# Altium project Gate Driver Board Motor Controller.PrjPcb (part 1 of 2)
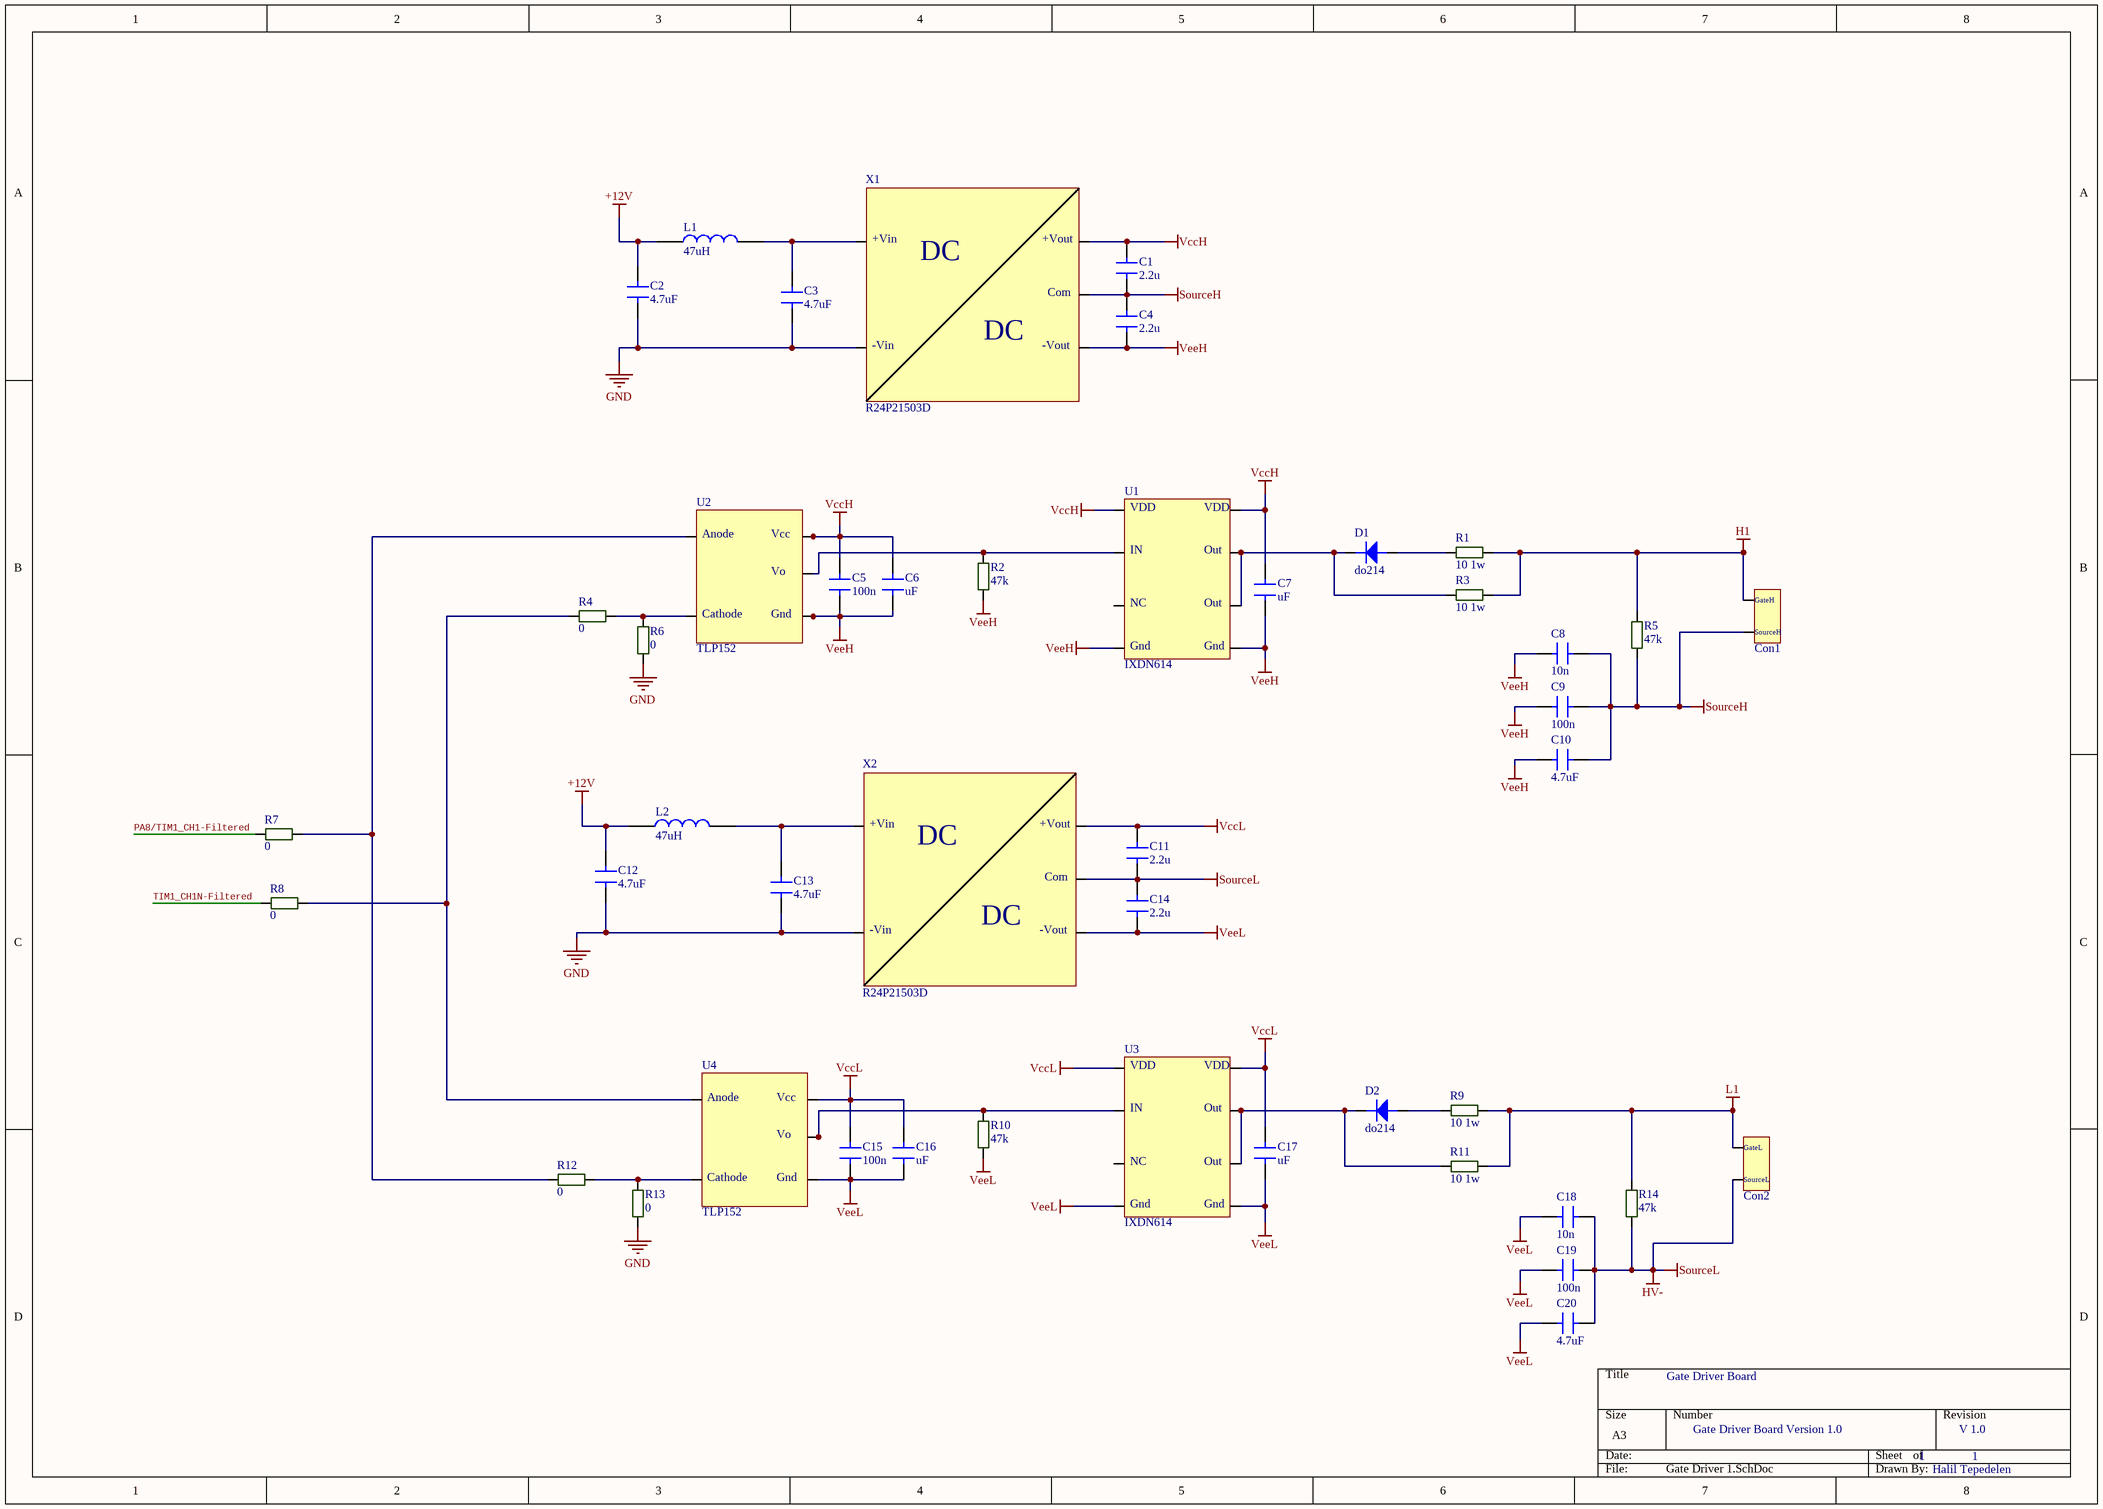
[diagram p0: Gate Driver 1.SchDoc]
12 sheets, 492 parts. Net scope: global (net labels, ports and power ports of the same name join across sheets).
Board file: Layout.PcbDoc
Sheets:
  Gate Driver 1.SchDoc
  Gate Driver 2.SchDoc
  Gate Driver 3.SchDoc
  Main MCU.SchDoc
  Automotive Connector.SchDoc
  PWM Filter.SchDoc
  Voltage Regulation.SchDoc
  Output Driver.SchDoc
  Communication.SchDoc
  Current Voltage Sensors.SchDoc
  Input Filtering.SchDoc
  Mosfets.SchDoc

## Sheet Gate Driver 1.SchDoc
size A3

### Parts
C1  2.2u  [C-0805]
C2  4.7uF  [C-1206]
C3  4.7uF  [C-1206]
C4  2.2u  [C-0805]
C5  100n  [C-0805]
C6  uF  [C-1206]
C7  uF  [C-1206]
C8  10n  [C-0805]
C9  100n  [C-0805]
C10  4.7uF  [C-1206]
C11  2.2u  [C-0805]
C12  4.7uF  [C-1206]
C13  4.7uF  [C-1206]
C14  2.2u  [C-0805]
C15  100n  [C-0805]
C16  uF  [C-1206]
C17  uF  [C-1206]
C18  10n  [C-0805]
C19  100n  [C-0805]
C20  4.7uF  [C-1206]
Con1  Connector2_1  [Conn]  (value not drawn)
Con2  Connector2_2  [Conn]  (value not drawn)
D1  do214  [DO-214AC]
D2  do214  [DO-214AC]
L1  47uH  [WE-TPC_282892]
L2  47uH  [WE-TPC_282892]
R1  10 1w  [R-2512]
R2  47k  [R-0805]
R3  10 1w  [R-2512]
R4  0  [R-0805]
R5  47k  [R-0805]
R6  0  [R-0805]
R7  0  [R-0805]
R8  0  [R-0805]
R9  10 1w  [R-2512]
R10  47k  [R-0805]
R11  10 1w  [R-2512]
R12  0  [R-0805]
R13  0  [R-0805]
R14  47k  [R-0805]
U1  IXDN614  [FAN3122 Soic8]
U2  TLP152  [TLP152]
U3  IXDN614  [FAN3122 Soic8]
U4  TLP152  [TLP152]
X1  R24P21503D  [SIP7]
X2  R24P21503D  [SIP7]

### Nets
+12V: C2.2 C12.2 L1.1 L2.1
GND: C2.1 C3.1 C12.1 C13.1 R6.1 R13.1 X1.2 X2.2
H1: Con1.1 R1.2 R3.2 R5.2
HV-: C11.1 C14.2 C18.1 C19.1 C20.2 Con2.2 R14.1 X2.6  [also labelled SourceL]
L1: Con2.1 R9.2 R11.2 R14.2
SourceH: C1.1 C4.2 C8.1 C9.1 C10.2 Con1.2 R5.1 X1.6
VccH: C1.2 C5.2 C6.2 C7.2 U1.1 U1.8 U2.5 X1.7
VccL: C11.2 C15.2 C16.2 C17.2 U3.1 U3.8 U4.5 X2.7
VeeH: C4.1 C5.1 C6.1 C7.1 C8.2 C9.2 C10.1 R2.1 U1.4 U1.5 U2.3 X1.5
VeeL: C14.1 C15.1 C16.1 C17.1 C18.2 C19.2 C20.1 R10.1 U3.4 U3.5 U4.3 X2.5
PA8/TIM1_CH1-Filtered: R7.1
TIM1_CH1N-Filtered: R8.1
NetC3_2: C3.2 L1.2 X1.1
NetC13_2: C13.2 L2.2 X2.1
NetD1_a: D1.a R1.1
NetD1_k: D1.k R3.1 U1.6 U1.7
NetD2_a: D2.a R9.1
NetD2_k: D2.k R11.1 U3.6 U3.7
NetR2_2: R2.2 U1.2 U2.4
NetR4_1: R4.1 R8.2 U4.1
NetR4_2: R4.2 R6.2 U2.2
NetR7_2: R7.2 R12.1 U2.1
NetR10_2: R10.2 U3.2 U4.4
NetR12_2: R12.2 R13.2 U4.2

Not connected (* = marked no-connect by the designer): U1 3; U3 3

### Notes on the sheet
- Gate Driver Board
- Gate Driver Board Version 1.0
- 1
- V 1.0
- Halil Tepedelen
- (in symbol Connector2_1) GateH; SourceH
- (in symbol Connector2_2) GateL; SourceL
- (in symbol IXDN614SITR) VDD; IN; Out; NC; Gnd
- (in symbol R24P21503D) +Vin; +Vout; DC; Com; -Vin; -Vout
- (in symbol TLP152(TPL,E) Anode; Vcc; Vo; Cathode; Gnd

### Library data of the parts
C1 C4 C5 C8 C9 C11 C14 C15 C18 C19 = C-0805
C2 C3 C10 C12 C13 C20 = Cap1206: MLCC (3216) 1206 4.7uF 50VDC ±10% X7R; Özdisan Part Number: CL31B475KBHNNNE; Manufacturer: SAMSUNG; Link: https://www.ozdisan.com/pasif-komponentler/kondansatorler/smd-kondansatorler-mlcc/CL31B475KBHNNNE; Price: 0,10407
C6 C7 C16 C17 = C-1206
D1 D2 = do214: DIODE FAST SWITCHING Single 150mA 75V SMT SOD323
L1 L2 = inductor
R1 R3 R9 R11 = R-2512
R2 = Res0805: RES.(2012) 0805 47K Ohms 5% 1/8W-S 100PPM; Manufacturer: ROYALOHM; Özdisan Part Number: 0805S8J0473T5E; Link: https://www.ozdisan.com/pasif-komponentler/direncler/smt-smd-direncler/0805S8J0473T5E; Price: 0,00234
R4 R6-R8 R12 R13 = Res0805: RES.(2012) 0805 0 Ohms 5% 1/8W-S 800PPM; Manufacturer: ROYALOHM; Özdisan Part Number: 0805S8J0000T5E; Price: 0,00234; Link: https://www.ozdisan.com/pasif-komponentler/direncler/smt-smd-direncler/0805S8J0000T5E
R5 R10 R14 = Res0805: RES.(2012) 0805 47K Ohms 5% 1/8W-S 100PPM; Özdisan Part Number: 0805S8J0473T5E; Manufacturer: ROYALOHM; Link: https://www.ozdisan.com/pasif-komponentler/direncler/smt-smd-direncler/0805S8J0473T5E; Price: 0,00234
U1 U3 = IXDN614SITR: 14A 8SOIC EXP MTL NON INVERTING; Manufacturer: Ixys Clare; Rise Time: 35ns; Propagation Delay: 70ns; Max Supply Voltage: 35V; Min Supply Voltage: 4.5V; Number of Outputs: 1; Fall Time: 25ns; ComponentLink1URL: https://datasheet.ciiva.com/6613/ixd-614-6613145.pdf?src-supplier=Digi-Key; ComponentLink1Description: https://datasheet.ciiva.com/6613/ixd-614-6613145.pdf?src-supplier=Digi-Key; Supplier 1: Mouser; Manufacturer Part Number: IXDN614SITR; RoHS: Yes; Pricing 1: 1 = 4.24000, 10 = 3.79000, 50 = 3.41000, 100 = 3.10000, 1000 = 2.12000, 10000 = 1.90000 (USD); Mount: Surface Mount; Case/Package: SOIC; Number of Pins: 8; Min Operating Temperature: -40°C; Max Operating Temperature: 125°C; Max Output Current: 14A; Packaging: Tape and Reel; Package Quantity: 2000; Number of Drivers: 1; Lead Free: Lead Free; Supplier Part Number 1: 849-IXDN614SITR
U2 U4 = TLP152(TPL,E: OPTOISO 3.75KV GATE DRIVER 6SO-5; Manufacturer: Toshiba; Number of Channels: 1; Propagation Delay: 165ns; Max Power Dissipation: 260mW; Direction: Unidirectional; Turn-On Delay Time: 190ns; Fall Time: 22ns; Forward Voltage: 1.57V; Output Current: 2.5A; Forward Current: 10mA; Rise Time: 18ns; High Level Output Current: 2A; Pulse Width Distortion (PWD): 50ns; ComponentLink1URL: https://datasheet.ciiva.com/41848/tlp152-datasheet-en-20120914-41848928.pdf?src-supplier=Digi-Key; ComponentLink1Description: https://datasheet.ciiva.com/41848/tlp152-datasheet-en-20120914-41848928.pdf?src-supplier=Digi-Key; Supplier 1: Mouser; Manufacturer Part Number: TLP152(TPL,E; RoHS: Yes; Stock 1: 22321; Pricing 1: 1 = 1.55000, 10 = 0.96800, 50 = 0.96800, 100 = 0.87200, 1000 = 0.54300, 10000 = 0.44000 (USD); Mount: Surface Mount; Case/Package: SO; Number of Pins: 5; Min Operating Temperature: -40°C; Max Operating Temperature: 100°C; Packaging: Tape and Reel; Package Quantity: 3000; Low Level Output Current: 2A; Max Output Current: 2.5A; Supplier Part Number 1: 757-TLP152TPLE
X1 X2 = R24P21503D: Manufacturer: Recom; Max Output Voltage: 15V; Supplier 1: Digi-Key; Manufacturer Part Number: R24P21503D; RoHS: No; Stock 1: 378; Pricing 1: 1 = 8.78000, 5 = 8.71200, 10 = 8.64500, 25 = 8.51200, 50 = 8.24600, 100 = 7.44800, 250 = 7.31500, 500 = 7.18200 (USD); Weight: 4.3g; Length: 19.5mm; Height: 12.5mm; Width: 9.8mm; Supplier Part Number 1: 945-3071-5-ND
Con1 = Connector2_1: System: Connector
Con2 = Connector2_2: System: Connector

## Sheet Gate Driver 2.SchDoc
size A3
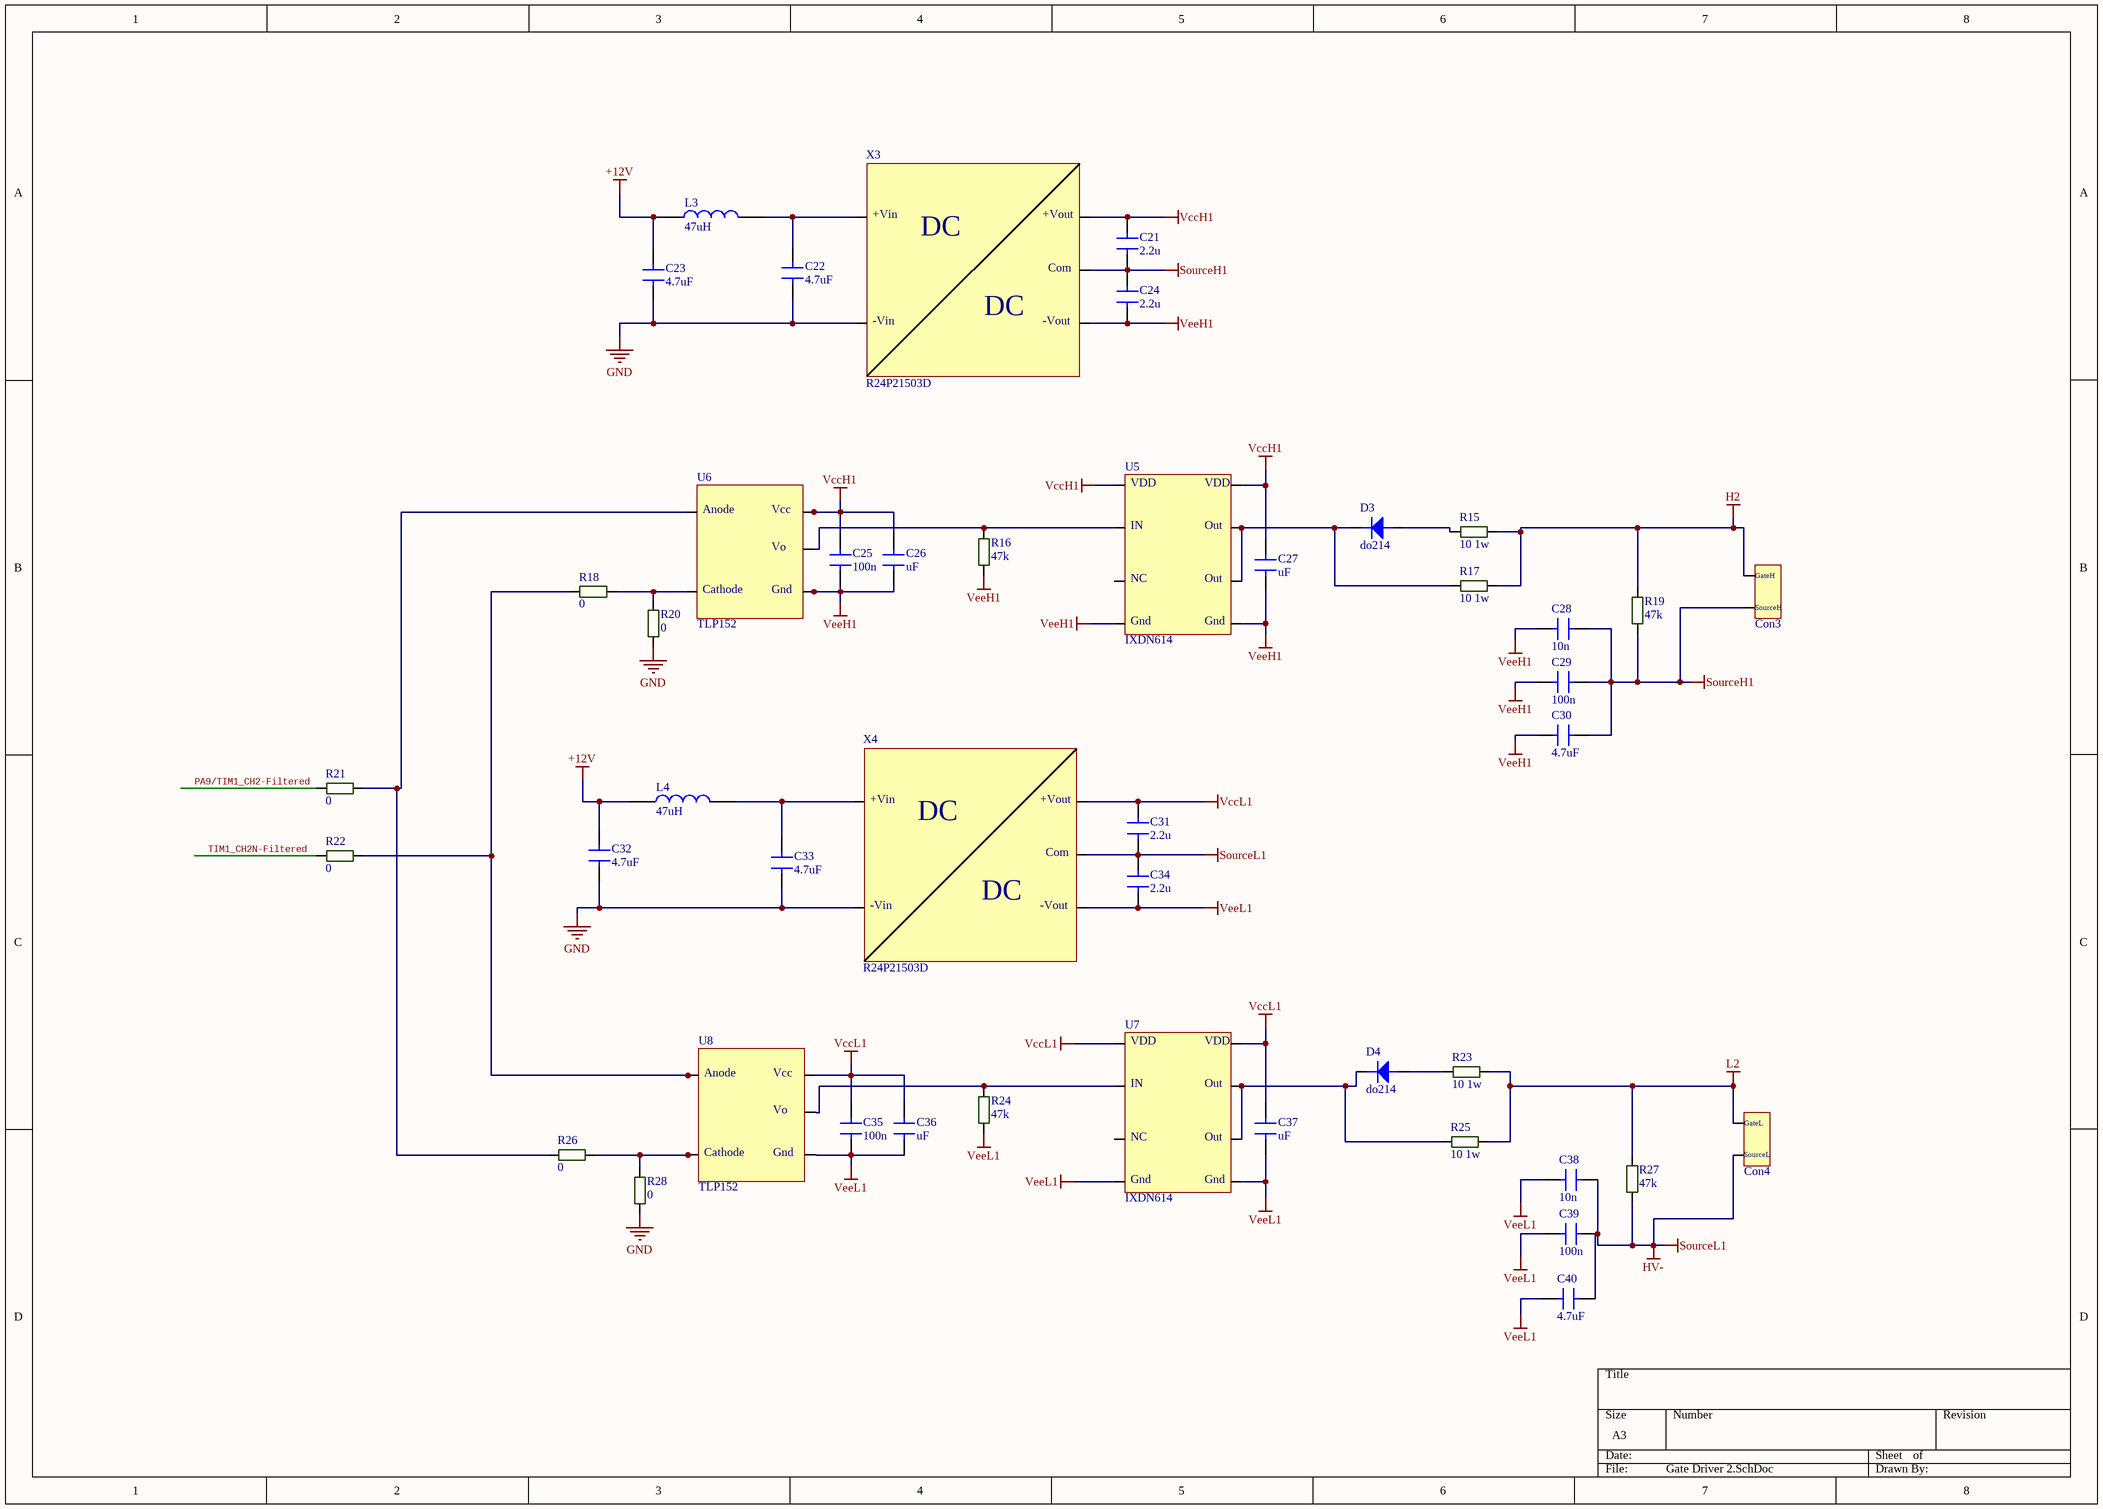
[diagram p1: Gate Driver 2.SchDoc]

### Parts
C21  2.2u  [C-0805]
C22  4.7uF  [C-1206]
C23  4.7uF  [C-1206]
C24  2.2u  [C-0805]
C25  100n  [C-0805]
C26  uF  [C-1206]
C27  uF  [C-1206]
C28  10n  [C-0805]
C29  100n  [C-0805]
C30  4.7uF  [C-1206]
C31  2.2u  [C-0805]
C32  4.7uF  [C-1206]
C33  4.7uF  [C-1206]
C34  2.2u  [C-0805]
C35  100n  [C-0805]
C36  uF  [C-1206]
C37  uF  [C-1206]
C38  10n  [C-0805]
C39  100n  [C-0805]
C40  4.7uF  [C-1206]
Con3  Connector2_1  [Conn]  (value not drawn)
Con4  Connector2_2  [Conn]  (value not drawn)
D3  do214  [DO-214AC]
D4  do214  [DO-214AC]
L3  47uH  [WE-TPC_282892]
L4  47uH  [WE-TPC_282892]
R15  10 1w  [R-2512]
R16  47k  [R-0805]
R17  10 1w  [R-2512]
R18  0  [R-0805]
R19  47k  [R-0805]
R20  0  [R-0805]
R21  0  [R-0805]
R22  0  [R-0805]
R23  10 1w  [R-2512]
R24  47k  [R-0805]
R25  10 1w  [R-2512]
R26  0  [R-0805]
R27  47k  [R-0805]
R28  0  [R-0805]
U5  IXDN614  [FAN3122 Soic8]
U6  TLP152  [TLP152]
U7  IXDN614  [FAN3122 Soic8]
U8  TLP152  [TLP152]
X3  R24P21503D  [SIP7]
X4  R24P21503D  [SIP7]

### Nets
+12V: C23.2 C32.2 L3.1 L4.1
GND: C22.1 C23.1 C32.1 C33.1 R20.1 R28.1 X3.2 X4.2
H2: Con3.1 R15.2 R17.2 R19.2
HV-: C31.1 C34.2 C38.1 C39.1 C40.2 Con4.2 R27.1 X4.6  [also labelled SourceL1]
L2: Con4.1 R23.2 R25.2 R27.2
SourceH1: C21.1 C24.2 C28.1 C29.1 C30.2 Con3.2 R19.1 X3.6
VccH1: C21.2 C25.2 C26.2 C27.2 U5.1 U5.8 U6.5 X3.7
VccL1: C31.2 C35.2 C36.2 C37.2 U7.1 U7.8 U8.5 X4.7
VeeH1: C24.1 C25.1 C26.1 C27.1 C28.2 C29.2 C30.1 R16.1 U5.4 U5.5 U6.3 X3.5
VeeL1: C34.1 C35.1 C36.1 C37.1 C38.2 C39.2 C40.1 R24.1 U7.4 U7.5 U8.3 X4.5
PA9/TIM1_CH2-Filtered: R21.1
TIM1_CH2N-Filtered: R22.1
NetC22_2: C22.2 L3.2 X3.1
NetC33_2: C33.2 L4.2 X4.1
NetD3_a: D3.a R15.1
NetD3_k: D3.k R17.1 U5.6 U5.7
NetD4_a: D4.a R23.1
NetD4_k: D4.k R25.1 U7.6 U7.7
NetR16_2: R16.2 U5.2 U6.4
NetR18_1: R18.1 R22.2 U8.1
NetR18_2: R18.2 R20.2 U6.2
NetR21_2: R21.2 R26.1 U6.1
NetR24_2: R24.2 U7.2 U8.4
NetR26_2: R26.2 R28.2 U8.2

Not connected (* = marked no-connect by the designer): U5 3; U7 3

### Notes on the sheet
- (in symbol Connector2_1) GateH; SourceH
- (in symbol Connector2_2) GateL; SourceL
- (in symbol IXDN614SITR) VDD; IN; Out; NC; Gnd
- (in symbol R24P21503D) +Vin; +Vout; DC; Com; -Vin; -Vout
- (in symbol TLP152(TPL,E) Anode; Vcc; Vo; Cathode; Gnd

### Library data of the parts
C21 C24 C25 C28 C29 C31 C34 C35 C38 C39 = C-0805
C22 C23 C30 C32 C33 C40 = Cap1206: as C2 on sheet Gate Driver 1; Link: https://www.ozdisan.com/pasif-komponentler/kondansatorler/smd-kondansatorler-mlcc/CL31B475KBHNNNE; Price: 0,10407
C26 C27 C36 C37 = C-1206
D3 D4 = do214: as D1 on sheet Gate Driver 1
L3 L4 = inductor
R15 R17 R23 R25 = R-2512
R16 = Res0805: as R2 on sheet Gate Driver 1; Link: https://www.ozdisan.com/pasif-komponentler/direncler/smt-smd-direncler/0805S8J0473T5E; Price: 0,00234
R18 R20-R22 R26 R28 = Res0805: as R4 on sheet Gate Driver 1; Price: 0,00234; Link: https://www.ozdisan.com/pasif-komponentler/direncler/smt-smd-direncler/0805S8J0000T5E
R19 R24 R27 = Res0805: as R5 on sheet Gate Driver 1; Link: https://www.ozdisan.com/pasif-komponentler/direncler/smt-smd-direncler/0805S8J0473T5E; Price: 0,00234
U5 U7 = IXDN614SITR: as U1 on sheet Gate Driver 1; ComponentLink1URL: https://datasheet.ciiva.com/6613/ixd-614-6613145.pdf?src-supplier=Digi-Key; ComponentLink1Description: https://datasheet.ciiva.com/6613/ixd-614-6613145.pdf?src-supplier=Digi-Key; Supplier 1: Mouser; Manufacturer Part Number: IXDN614SITR; RoHS: Yes; Pricing 1: 1 = 4.24000, 10 = 3.79000, 50 = 3.41000, 100 = 3.10000, 1000 = 2.12000, 10000 = 1.90000 (USD); Mount: Surface Mount; Case/Package: SOIC; Number of Pins: 8; Min Operating Temperature: -40°C; Max Operating Temperature: 125°C; Max Output Current: 14A; Packaging: Tape and Reel; Package Quantity: 2000; Number of Drivers: 1; Lead Free: Lead Free; Supplier Part Number 1: 849-IXDN614SITR
U6 U8 = TLP152(TPL,E: as U2 on sheet Gate Driver 1; ComponentLink1URL: https://datasheet.ciiva.com/41848/tlp152-datasheet-en-20120914-41848928.pdf?src-supplier=Digi-Key; ComponentLink1Description: https://datasheet.ciiva.com/41848/tlp152-datasheet-en-20120914-41848928.pdf?src-supplier=Digi-Key; Supplier 1: Mouser; Manufacturer Part Number: TLP152(TPL,E; RoHS: Yes; Stock 1: 22321; Pricing 1: 1 = 1.55000, 10 = 0.96800, 50 = 0.96800, 100 = 0.87200, 1000 = 0.54300, 10000 = 0.44000 (USD); Mount: Surface Mount; Case/Package: SO; Number of Pins: 5; Min Operating Temperature: -40°C; Max Operating Temperature: 100°C; Packaging: Tape and Reel; Package Quantity: 3000; Low Level Output Current: 2A; Max Output Current: 2.5A; Supplier Part Number 1: 757-TLP152TPLE
X3 X4 = R24P21503D: as X1 on sheet Gate Driver 1; Supplier 1: Digi-Key; Manufacturer Part Number: R24P21503D; RoHS: No; Stock 1: 378; Pricing 1: 1 = 8.78000, 5 = 8.71200, 10 = 8.64500, 25 = 8.51200, 50 = 8.24600, 100 = 7.44800, 250 = 7.31500, 500 = 7.18200 (USD); Weight: 4.3g; Length: 19.5mm; Height: 12.5mm; Width: 9.8mm; Supplier Part Number 1: 945-3071-5-ND
Con3 = Connector2_1: System: Connector
Con4 = Connector2_2: System: Connector

## Sheet Gate Driver 3.SchDoc
size A3
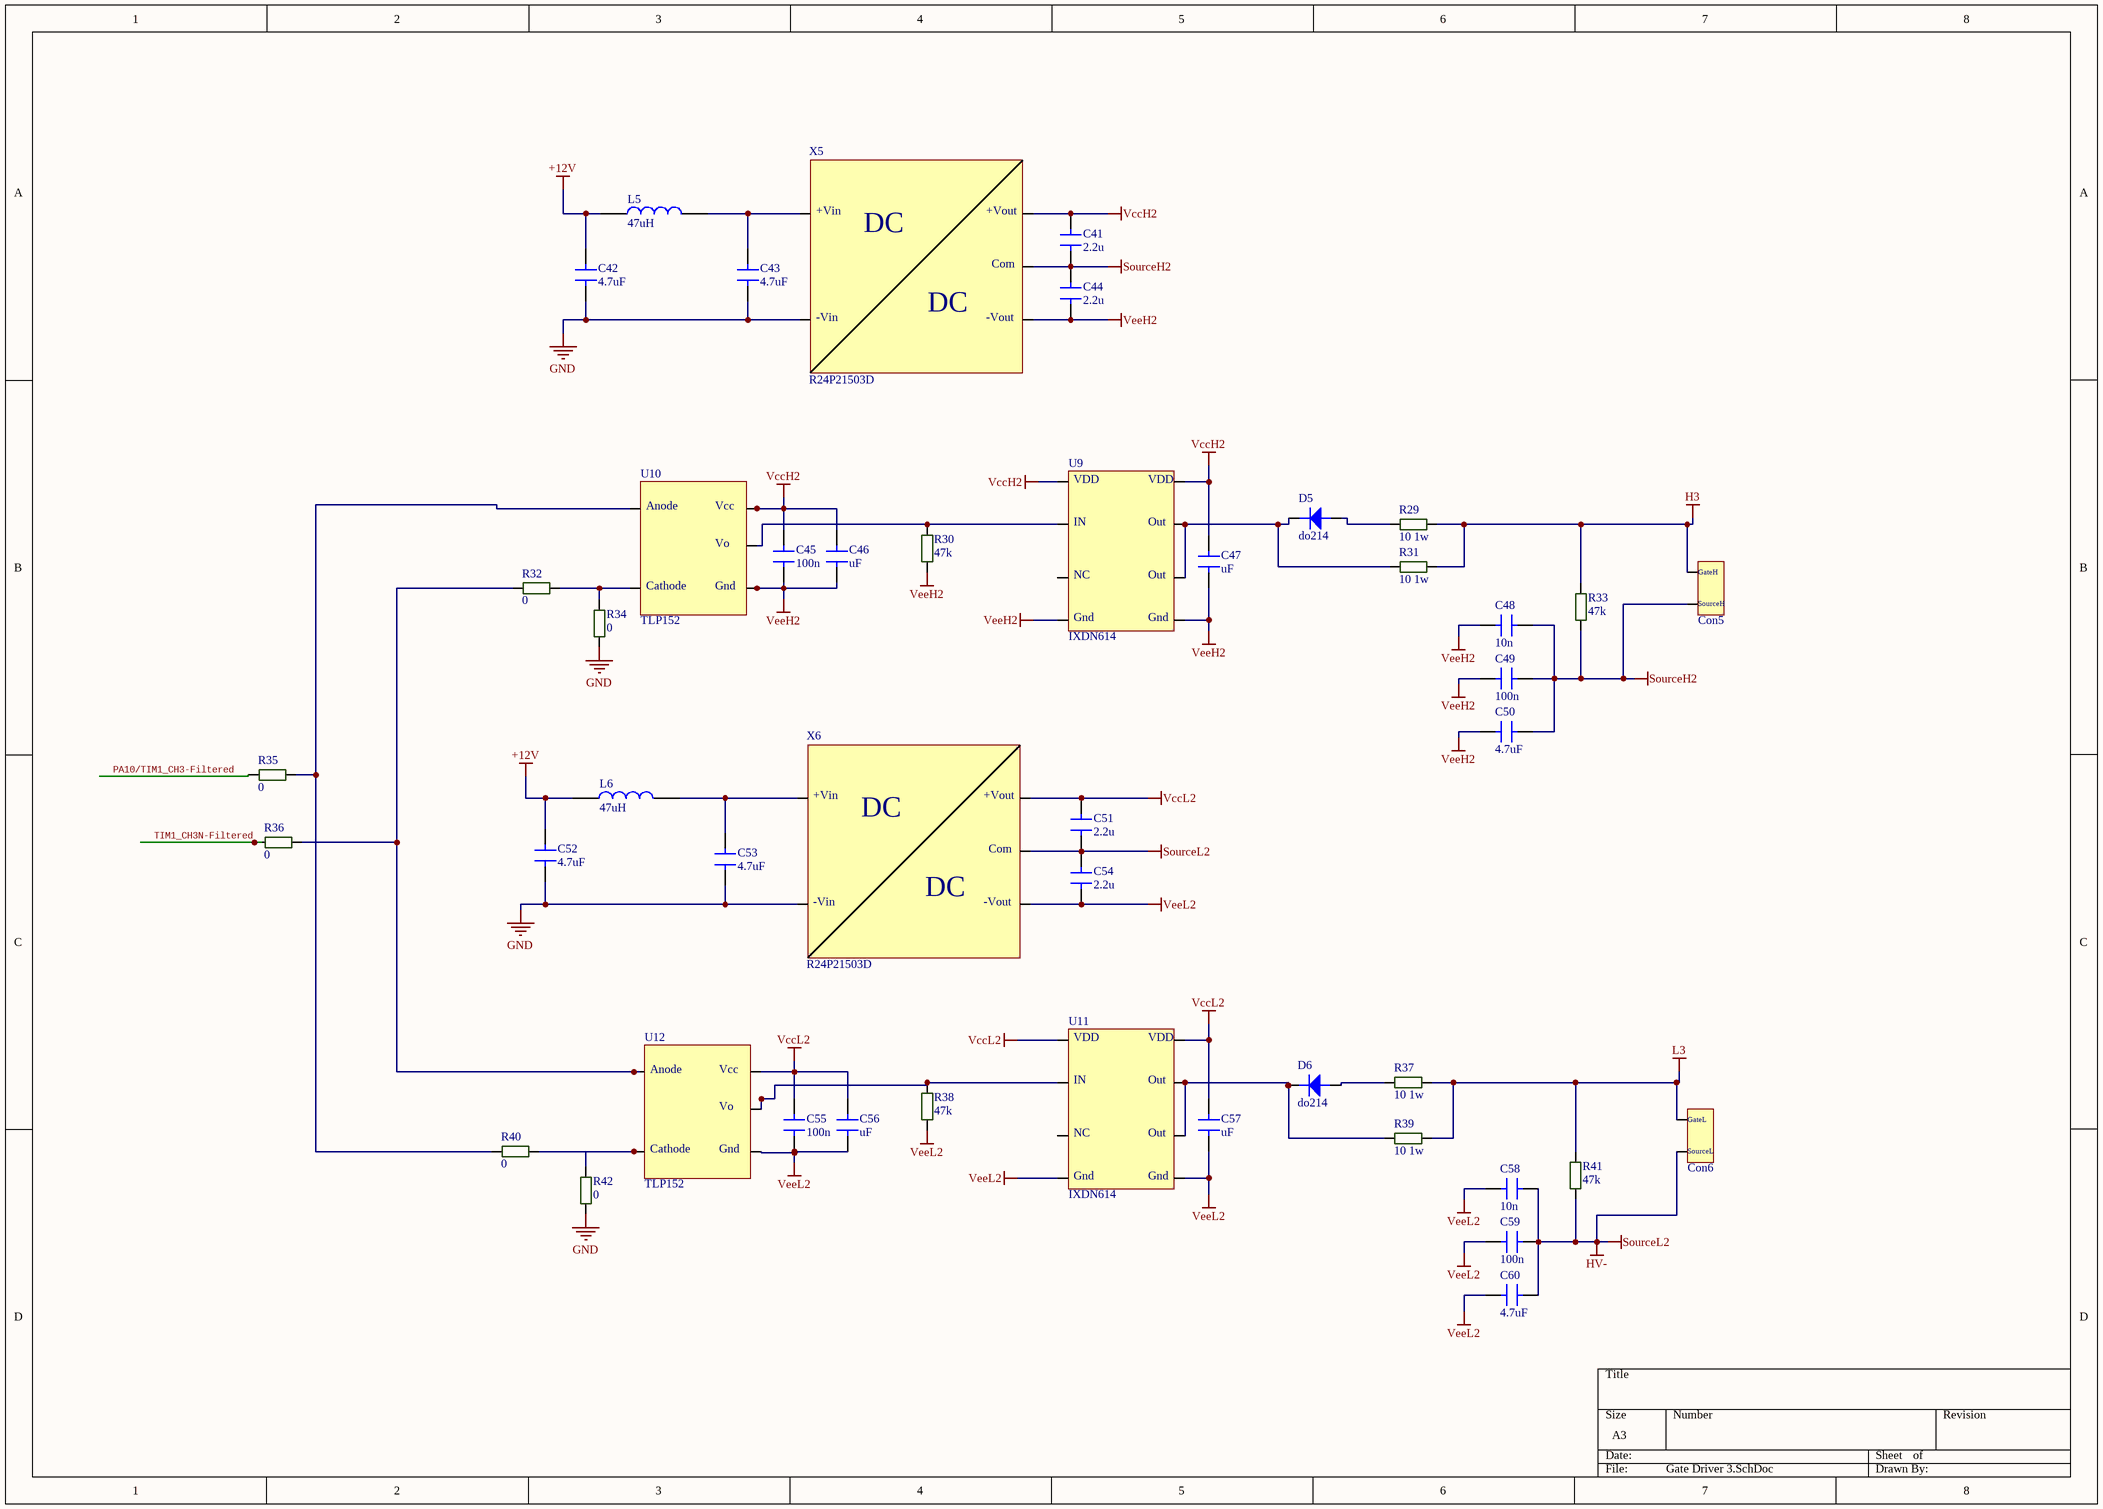
[diagram p2: Gate Driver 3.SchDoc]

### Parts
C41  2.2u  [C-0805]
C42  4.7uF  [C-1206]
C43  4.7uF  [C-1206]
C44  2.2u  [C-0805]
C45  100n  [C-0805]
C46  uF  [C-1206]
C47  uF  [C-1206]
C48  10n  [C-0805]
C49  100n  [C-0805]
C50  4.7uF  [C-1206]
C51  2.2u  [C-0805]
C52  4.7uF  [C-1206]
C53  4.7uF  [C-1206]
C54  2.2u  [C-0805]
C55  100n  [C-0805]
C56  uF  [C-1206]
C57  uF  [C-1206]
C58  10n  [C-0805]
C59  100n  [C-0805]
C60  4.7uF  [C-1206]
Con5  Connector2_1  [Conn]  (value not drawn)
Con6  Connector2_2  [Conn]  (value not drawn)
D5  do214  [DO-214AC]
D6  do214  [DO-214AC]
L5  47uH  [WE-TPC_282892]
L6  47uH  [WE-TPC_282892]
R29  10 1w  [R-2512]
R30  47k  [R-0805]
R31  10 1w  [R-2512]
R32  0  [R-0805]
R33  47k  [R-0805]
R34  0  [R-0805]
R35  0  [R-0805]
R36  0  [R-0805]
R37  10 1w  [R-2512]
R38  47k  [R-0805]
R39  10 1w  [R-2512]
R40  0  [R-0805]
R41  47k  [R-0805]
R42  0  [R-0805]
U9  IXDN614  [FAN3122 Soic8]
U10  TLP152  [TLP152]
U11  IXDN614  [FAN3122 Soic8]
U12  TLP152  [TLP152]
X5  R24P21503D  [SIP7]
X6  R24P21503D  [SIP7]

### Nets
+12V: C42.2 C52.2 L5.1 L6.1
GND: C42.1 C43.1 C52.1 C53.1 R34.1 R42.1 X5.2 X6.2
H3: Con5.1 R29.2 R31.2 R33.2
HV-: C51.1 C54.2 C58.1 C59.1 C60.2 Con6.2 R41.1 X6.6  [also labelled SourceL2]
L3: Con6.1 R37.2 R39.2 R41.2
SourceH2: C41.1 C44.2 C48.1 C49.1 C50.2 Con5.2 R33.1 X5.6  [project net C]
VccH2: C41.2 C45.2 C46.2 C47.2 U9.1 U9.8 U10.5 X5.7
VccL2: C51.2 C55.2 C56.2 C57.2 U11.1 U11.8 U12.5 X6.7
VeeH2: C44.1 C45.1 C46.1 C47.1 C48.2 C49.2 C50.1 R30.1 U9.4 U9.5 U10.3 X5.5
VeeL2: C54.1 C55.1 C56.1 C57.1 C58.2 C59.2 C60.1 R38.1 U11.4 U11.5 U12.3 X6.5
PA10/TIM1_CH3-Filtered: R35.1
TIM1_CH3N-Filtered: R36.1
NetC43_2: C43.2 L5.2 X5.1
NetC53_2: C53.2 L6.2 X6.1
NetD5_a: D5.a R29.1
NetD5_k: D5.k R31.1 U9.6 U9.7
NetD6_a: D6.a R37.1
NetD6_k: D6.k R39.1 U11.6 U11.7
NetR30_2: R30.2 U9.2 U10.4
NetR32_1: R32.1 R36.2 U12.1
NetR32_2: R32.2 R34.2 U10.2
NetR35_2: R35.2 R40.1 U10.1
NetR38_2: R38.2 U11.2 U12.4
NetR40_2: R40.2 R42.2 U12.2

Not connected (* = marked no-connect by the designer): U9 3; U11 3

### Notes on the sheet
- (in symbol Connector2_1) GateH; SourceH
- (in symbol Connector2_2) GateL; SourceL
- (in symbol IXDN614SITR) VDD; IN; Out; NC; Gnd
- (in symbol R24P21503D) +Vin; +Vout; DC; Com; -Vin; -Vout
- (in symbol TLP152(TPL,E) Anode; Vcc; Vo; Cathode; Gnd

### Library data of the parts
C41 C44 C45 C48 C49 C51 C54 C55 C58 C59 = C-0805
C42 C43 C50 C52 C53 C60 = Cap1206: as C2 on sheet Gate Driver 1; Link: https://www.ozdisan.com/pasif-komponentler/kondansatorler/smd-kondansatorler-mlcc/CL31B475KBHNNNE; Price: 0,10407
C46 C47 C56 C57 = C-1206
D5 D6 = do214: as D1 on sheet Gate Driver 1
L5 L6 = inductor
R29 R31 R37 R39 = R-2512
R30 = Res0805: as R2 on sheet Gate Driver 1; Link: https://www.ozdisan.com/pasif-komponentler/direncler/smt-smd-direncler/0805S8J0473T5E; Price: 0,00234
R32 R34-R36 R40 R42 = Res0805: as R4 on sheet Gate Driver 1; Price: 0,00234; Link: https://www.ozdisan.com/pasif-komponentler/direncler/smt-smd-direncler/0805S8J0000T5E
R33 R38 R41 = Res0805: as R5 on sheet Gate Driver 1; Link: https://www.ozdisan.com/pasif-komponentler/direncler/smt-smd-direncler/0805S8J0473T5E; Price: 0,00234
U9 U11 = IXDN614SITR: as U1 on sheet Gate Driver 1; ComponentLink1URL: https://datasheet.ciiva.com/6613/ixd-614-6613145.pdf?src-supplier=Digi-Key; ComponentLink1Description: https://datasheet.ciiva.com/6613/ixd-614-6613145.pdf?src-supplier=Digi-Key; Supplier 1: Mouser; Manufacturer Part Number: IXDN614SITR; RoHS: Yes; Pricing 1: 1 = 4.24000, 10 = 3.79000, 50 = 3.41000, 100 = 3.10000, 1000 = 2.12000, 10000 = 1.90000 (USD); Mount: Surface Mount; Case/Package: SOIC; Number of Pins: 8; Min Operating Temperature: -40°C; Max Operating Temperature: 125°C; Max Output Current: 14A; Packaging: Tape and Reel; Package Quantity: 2000; Number of Drivers: 1; Lead Free: Lead Free; Supplier Part Number 1: 849-IXDN614SITR
U10 U12 = TLP152(TPL,E: as U2 on sheet Gate Driver 1; ComponentLink1URL: https://datasheet.ciiva.com/41848/tlp152-datasheet-en-20120914-41848928.pdf?src-supplier=Digi-Key; ComponentLink1Description: https://datasheet.ciiva.com/41848/tlp152-datasheet-en-20120914-41848928.pdf?src-supplier=Digi-Key; Supplier 1: Mouser; Manufacturer Part Number: TLP152(TPL,E; RoHS: Yes; Stock 1: 22321; Pricing 1: 1 = 1.55000, 10 = 0.96800, 50 = 0.96800, 100 = 0.87200, 1000 = 0.54300, 10000 = 0.44000 (USD); Mount: Surface Mount; Case/Package: SO; Number of Pins: 5; Min Operating Temperature: -40°C; Max Operating Temperature: 100°C; Packaging: Tape and Reel; Package Quantity: 3000; Low Level Output Current: 2A; Max Output Current: 2.5A; Supplier Part Number 1: 757-TLP152TPLE
X5 X6 = R24P21503D: as X1 on sheet Gate Driver 1; Supplier 1: Digi-Key; Manufacturer Part Number: R24P21503D; RoHS: No; Stock 1: 378; Pricing 1: 1 = 8.78000, 5 = 8.71200, 10 = 8.64500, 25 = 8.51200, 50 = 8.24600, 100 = 7.44800, 250 = 7.31500, 500 = 7.18200 (USD); Weight: 4.3g; Length: 19.5mm; Height: 12.5mm; Width: 9.8mm; Supplier Part Number 1: 945-3071-5-ND
Con5 = Connector2_1: System: Connector
Con6 = Connector2_2: System: Connector

## Sheet Main MCU.SchDoc
size A3
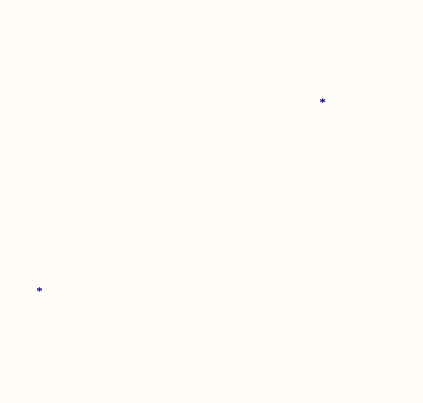
[diagram p3: Main MCU.SchDoc, left]
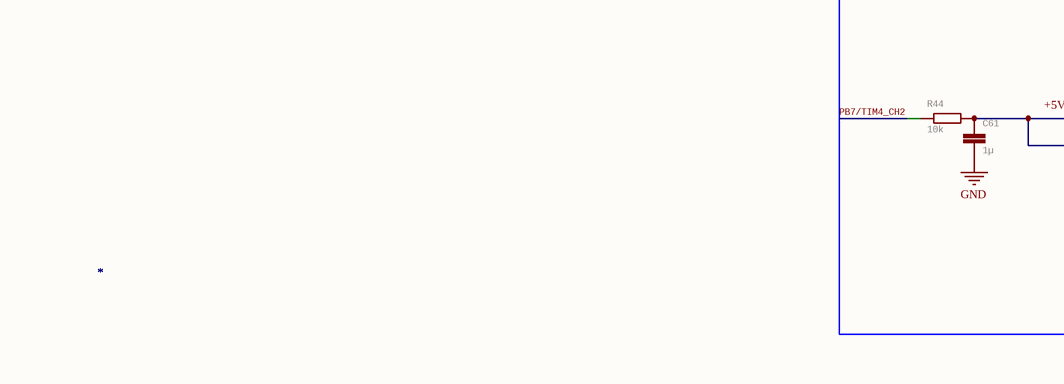
[diagram p4: Main MCU.SchDoc, middle]
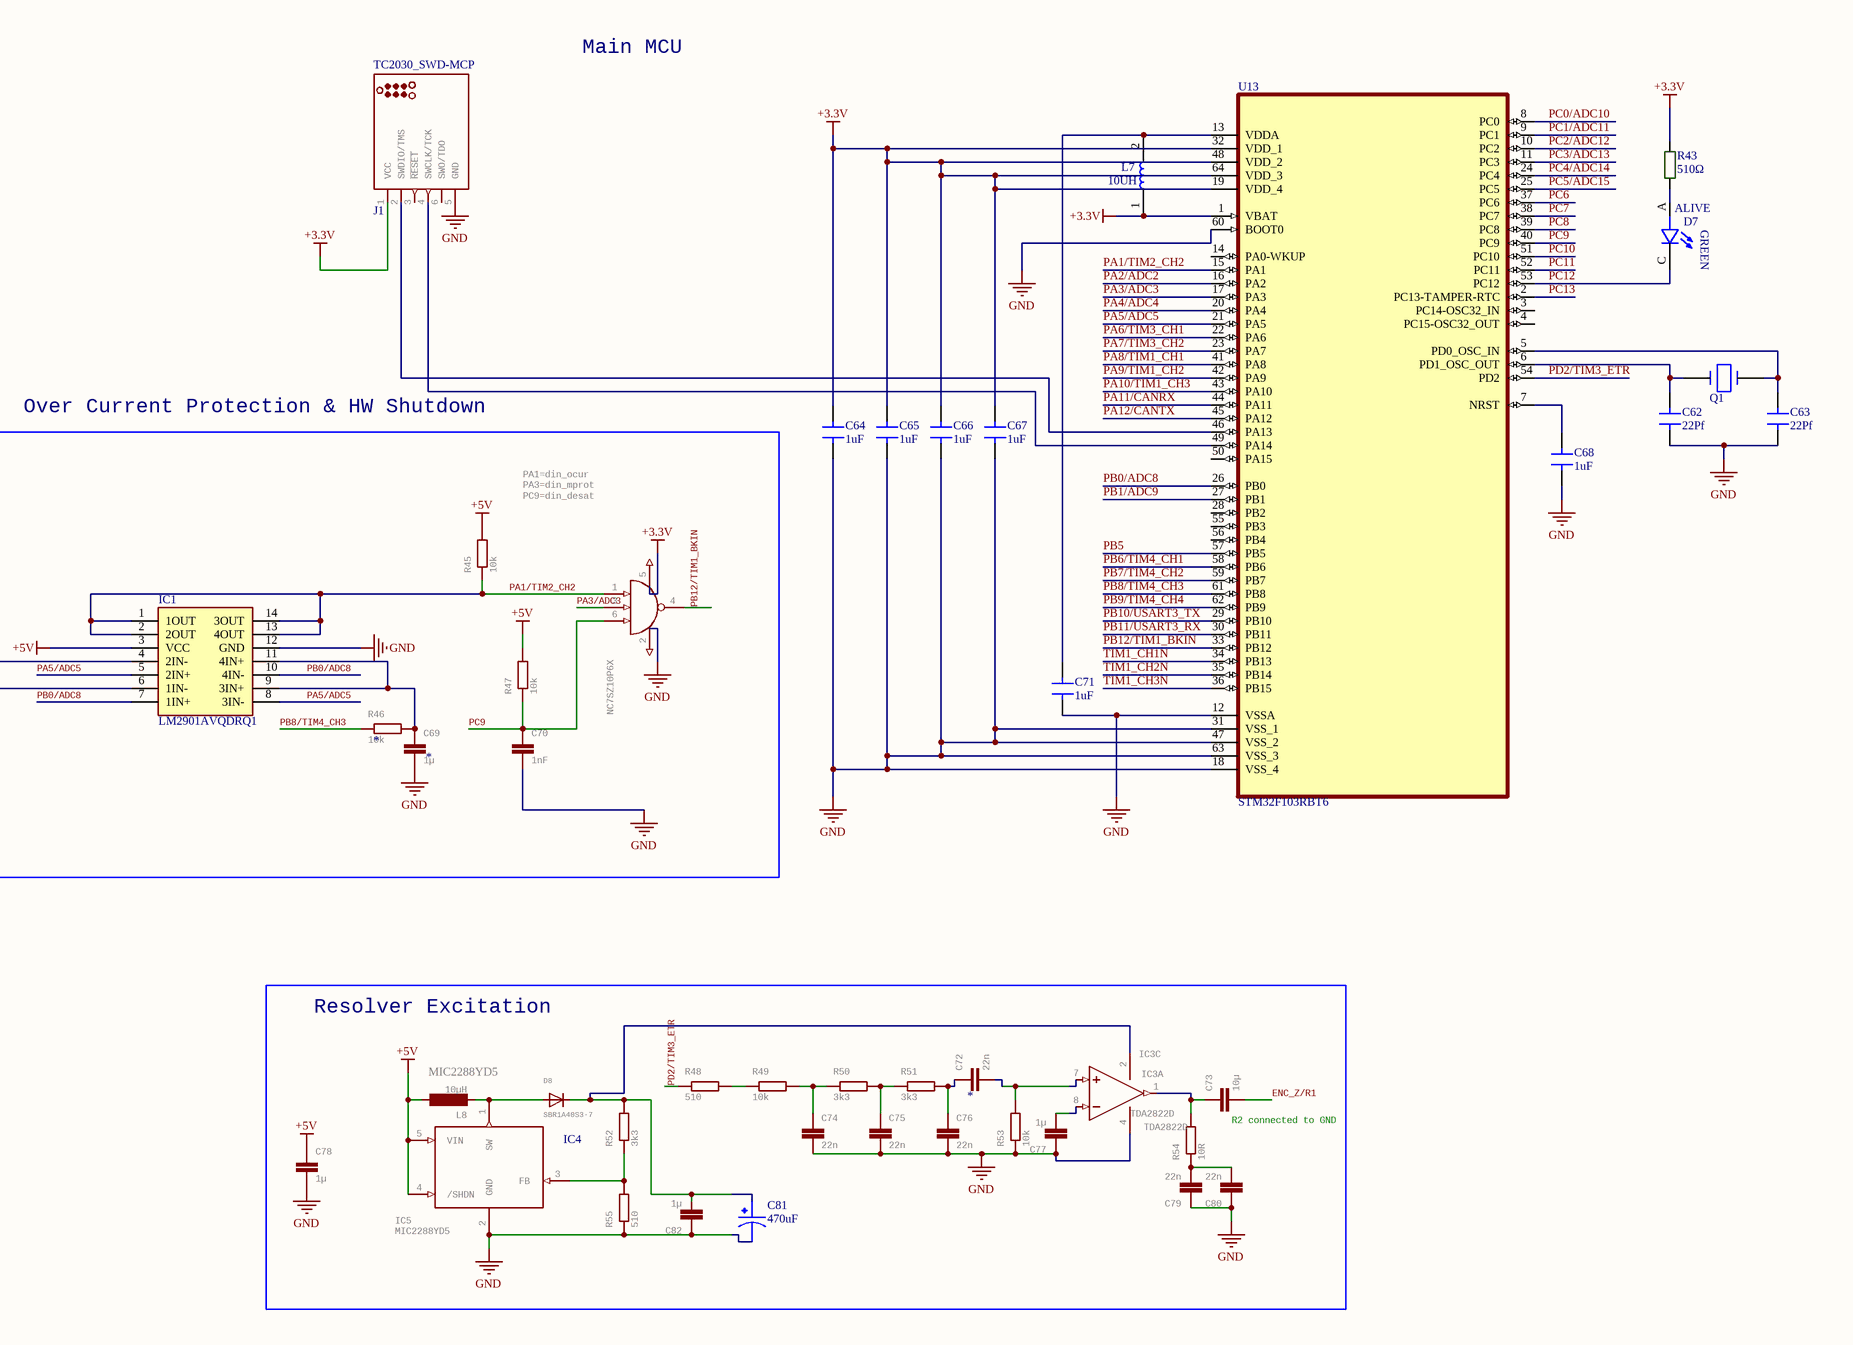
[diagram p5: Main MCU.SchDoc, right]

### Parts
(Parts that share a designator on the sheet are numbered #1, #2 ... from top to bottom, then left to right.)
C61  *  value 1µ  [C-0603W]
C62  22Pf  [C-0603W]
C63  22Pf  [C-0603W]
C64  1uF  [C-0603W]
C65  1uF  [C-0603W]
C66  1uF  [C-0603W]
C67  1uF  [C-0603W]
C68  1uF  [C-0603W]
C69  *  value 1µ  [C-0603W]
C70  *  value 1nF  [C-0603W]
C71  1uF  [C-0603W]
C72  *  value 22n  [C-0603W]
C73  *  value 10µ  [C-0805]
C74  *  value 22n  [C-0603W]
C75  *  value 22n  [C-0603W]
C76  *  value 22n  [C-0603W]
C77  *  value 1µ  [C-0603W]
C78  *  value 1µ  [C-0603W]
C79  *  value 22n  [C-0603W]
C80  *  value 22n  [C-0603W]
C81  470uF  [CapSmdElc]
C82  *  value 1µ  [C-0603W]
D7  ALIVE  [LED_7012X1]
D8  *  value SBR1A40S3-7  [SOD-323F]
IC1  LM2901AVQDRQ1  [SOIC127P600X175-14N]
IC3  TDA2822D  [SO08]  (parts A,C of 3)
IC4  MIC2288YD5  [SOT23-5L]
IC?#1  NC7SZ10P6X  [SC70-6]  (part A of 2)
J1  TC2030_SWD-MCP  [TC2030-MCP]
L7  10UH  [INDC2012X87N]
L8  *  value 10µH  [L2825P]
Q1  Crystal 8MHz  [5032-2P]  (value not drawn)
R43  510Ω  [R-0603R]
R44  *  value 10k  [R-0603R]
R45  *  value 10k  [R-0603R]
R46  *  value 10k  [R-0603R]
R47  *  value 10k  [R-0603R]
R48  *  value 510  [R-0603R]
R49  *  value 10k  [R-0603R]
R50  *  value 3k3  [R-0603R]
R51  *  value 3k3  [R-0603R]
R52  *  value 3k3  [R-0603R]
R53  *  value 10k  [R-0603R]
R54  *  value 10R  [R-0603R]
R55  *  value 510  [R-0603R]
U13  STM32F103RBT6  [QFP50P1200X1200X160-64N]

### Blocks framed on the sheet
Resolver Excitation: C72-C82 D8 IC3 IC4 L8 R48-R55

### Nets
+3.3V: C64.2 C65.2 C66.2 C67.2 IC?#1.5(I0) J1.1(VCC) L7.1 R43.2 U13.1(VBAT) U13.19(VDD_4) U13.32(VDD_1) U13.48(VDD_2) U13.64(VDD_3)
+5V: C78.1 IC1.3(VCC) IC4.4(/SHDN) IC4.5(VIN) L8.1 R45.2 R47.2
GND: C61.2 C62.1 C63.1 C64.1 C65.1 C66.1 C67.1 C68.1 C69.2 C70.2 C71.1 C74.2 C75.2 C76.2 C77.1 C78.2 C79.1 C80.1 C81.2 C82.1 IC1.12(GND) IC3.4(V-) IC4.2(GND) IC?#1.2(I0) J1.5(GND) R53.1 R55.1 U13.12(VSSA) U13.18(VSS_4) U13.31(VSS_1) U13.47(VSS_2) U13.60(BOOT0) U13.63(VSS_3)
ENC_Z/R1: C73.2
PA1/TIM2_CH2: IC1.1(1OUT) IC1.2(2OUT) IC1.13(4OUT) IC1.14(3OUT) IC?#1.1(I0) R45.1 U13.15(PA1)
PA2/ADC2: U13.16(PA2)
PA3/ADC3: IC?#1.3(I1) U13.17(PA3)
PA4/ADC4: U13.20(PA4)
PA5/ADC5: IC1.5(2IN+) IC1.8(3IN-) U13.21(PA5)
PA6/TIM3_CH1: U13.22(PA6)
PA7/TIM3_CH2: U13.23(PA7)
PA8/TIM1_CH1: U13.41(PA8)
PA9/TIM1_CH2: U13.42(PA9)
PA10/TIM1_CH3: U13.43(PA10)
PA11/CANRX: U13.44(PA11)
PA12/CANTX: U13.45(PA12)
PB0/ADC8: IC1.7(1IN+) IC1.10(4IN-) U13.26(PB0)
PB1/ADC9: U13.27(PB1)
PB5: U13.57(PB5)
PB6/TIM4_CH1: U13.58(PB6)
PB7/TIM4_CH2: R44.1 U13.59(PB7)
PB8/TIM4_CH3: R46.1 U13.61(PB8)
PB9/TIM4_CH4: U13.62(PB9)
PB10/USART3_TX: U13.29(PB10)
PB11/USART3_RX: U13.30(PB11)
PB12/TIM1_BKIN: IC?#1.4(O) U13.33(PB12)
PC0/ADC10: U13.8(PC0)
PC1/ADC11: U13.9(PC1)
PC2/ADC12: U13.10(PC2)
PC3/ADC13: U13.11(PC3)
PC4/ADC14: U13.24(PC4)
PC5/ADC15: U13.25(PC5)
PC6: U13.37(PC6)
PC7: U13.38(PC7)
PC8: U13.39(PC8)
PC9: C70.1 IC?#1.6(I2) R47.1 U13.40(PC9)
PC10: U13.51(PC10)
PC11: U13.52(PC11)
PC12: D7.C U13.53(PC12)
PC13: U13.2(PC13-TAMPER-RTC)
PD2/TIM3_ETR: R48.1 U13.54(PD2)
TIM1_CH1N: U13.34(PB13)
TIM1_CH2N: U13.35(PB14)
TIM1_CH3N: U13.36(PB15)
NetC61_1: C61.1 IC1.4(2IN-) IC1.6(1IN-) R44.2
NetC62_2: C62.2 Q1.1 U13.6(PD1_OSC_OUT)
NetC63_2: C63.2 Q1.2 U13.5(PD0_OSC_IN)
NetC68_2: C68.2 U13.7(NRST)
NetC69_1: C69.1 IC1.9(3IN+) IC1.11(4IN+) R46.2
NetC71_2: C71.2 L7.2 U13.13(VDDA)
NetC72_1: C72.1 C76.1 R51.2
NetC72_2: C72.2 IC3.7(+IN) R53.2
NetC73_1: C73.1 IC3.1(OUT) R54.2
NetC74_1: C74.1 R49.2 R50.1
NetC75_1: C75.1 R50.2 R51.1
NetC77_2: C77.2 IC3.8(-IN)
NetC79_2: C79.2 C80.2 R54.1
NetC81_1: C81.1 C82.2 D8.C IC3.2(V+) R52.2
NetD7_A: D7.A R43.1
NetD8_A: D8.A IC4.1(SW) L8.2
NetIC4_3: IC4.3(FB) R52.1 R55.2
NetJ1_2: J1.2(SWDIO/TMS) U13.46(PA13)
NetJ1_4: J1.4(SWCLK/TCK) U13.49(PA14)
NetR48_2: R48.2 R49.1

Not connected (* = marked no-connect by the designer): J1 3(~{RESET}) 6(SWO/TDO); U13 3(PC14-OSC32_IN) 4(PC15-OSC32_OUT) 14(PA0-WKUP) 28(PB2) 50(PA15) 55(PB3) 56(PB4)

### Notes on the sheet
- Main MCU
- Over Current Protection & HW Shutdown
- PA1=din_ocur
  PA3=din_mprot
  PC9=din_desat
- (near C73) R2 connected to GND
- (near IC4) IC5
  MIC2288YD5
- (in symbol ALIVE) GREEN

### Library data of the parts
C61 C69 C70 C72 C74-C80 C82 = C-EUC0603: CAPACITOR, European symbol; GateName_1: G$1; SymbolName_1: C-EU; DeviceName: C0603; LibraryName: rcl; DeviceSetName: C-EU
C62-C68 C71 = C-0603
C73 = C-EUC0805: CAPACITOR, European symbol; GateName_1: G$1; SymbolName_1: C-EU; DeviceName: C0805; LibraryName: rcl; DeviceSetName: C-EU
C81 = 100 uF Electr Cap
D7 = ALIVE: Green LED Indication - Discrete 1.7V 0805 (2012 Metric); MP: 7012X1; Package: None; Price: None; Value: *; Availability: Unavailable
D8 = DIODESOD-323F: Diode   SMADIODE - SMA Surface Mount Package  20V 1A Schottky Diode Digikey: 641-1014-6-ND    DO-1N4148 - Through Hole Small Current Diode SOD-123 20V 1 A (.5mV Vf) Schottky Diode - Digikey: MBRX120TPMSCT-ND    SOD-323 10V 570mA (.38mV Vf, 3ns) Schottky Diode - Digikey: ZLLS410CT-ND    SOD-523 30V 30mA Schottky Diode (RB751S-40TE61) - Digikey: RB751S-40TE61CT-ND    SOT23-R/W - SOT23 Package (R = Solder Paste/Reflow Ovens, W = Hand-Soldering)  BAT54Film 40V 300mA - Digikey: 497-7162-1-ND; GateName_1: G$1; SymbolName_1: DIODE; DeviceName: SOD-323F; LibraryName: adafruit; DeviceSetName: DIODE
IC1 = LM2901AVQDRQ1: Integrated Circuit; Manufacturer_Name: Texas Instruments; Datasheet Link: http://www.ti.com/lit/gpn/lm2901av-q1; Height: 1.75mm; Manufacturer_Part_Number: LM2901AVQDRQ1; Mouser Part Number: 595-LM2901AVQDRQ1; Mouser Price/Stock: https://www.mouser.co.uk/ProductDetail/Texas-Instruments/LM2901AVQDRQ1?qs=pAO1Z172M84zSPVjiTRtmQ%3D%3D; Arrow Part Number: LM2901AVQDRQ1; Arrow Price/Stock: https://www.arrow.com/en/products/lm2901avqdrq1/texas-instruments
IC3 = TDA2822D: OP AMP; GateName_1: A; SymbolName_1: OPAMP; GateName_2: B; GateName_3: P; SymbolName_3: PWR+-; DeviceName: D; SymbolName_2: OPAMP; LibraryName: st-microelectronics; DeviceSetName: TDA2822
IC4 = MIC2288YD5: GateName_1: G$1; DeviceName: YD5; SymbolName_1: MIC2288; LibraryName: adafruit; DeviceSetName: MIC2288
IC?#1 = 74*1G10X: 3-input NAND gate; GateName_1: >NAME; SymbolName_1: 7412; GateName_2: PWR; SymbolName_2: PWRN-1; DeviceName: X; LibraryName: 74xx-eu; DeviceSetName: 74*1G10
J1 = TC2030_SWD-MCP: ARM20-CTX 20-Pin to TC2030-IDC Adapter for Cortex           6-Pin (TC2030-IDC family)  Cortex SWD  Adapters                  The Tag-Connect ARM20-CTX adapter board allows our TC2030-IDC cables to be used for ARM SWD (Single Wire Debug) applications. Although intended for use with our patented TC2030-IDC (and TC2030-IDC-NL) Plug-of-Nailsâ„¢ Cables, the adapter may be useful to people wishing to use 6-pin 0.1â€ ribbon headers on their PCB instead of the traditional 20-Pin header.   Please note the TC2030-IDC or TC2030-IDC-NL cable is purchased separately, the cables and Segger JLINK seen in the pictures are not included!   Download the Datasheet here.; GateName_1: G$1; DeviceName: -MCP; SymbolName_1: SWD; LibraryName: tag-connect; DeviceSetName: TC2030_SWD
L7 = MLZ2012M100HTD25: FIXED IND 10UH 300MA 884 MOHM; Package: None; Price: None; Value: *; MP: MLZ2012M100HTD25; Availability: Unavailable
L8 = L-EUL2825P: INDUCTOR, European symbol; GateName_1: G$1; SymbolName_1: L-EU; DeviceName: L2825P; LibraryName: rcl; DeviceSetName: L-EU
Q1 = Crystal 8MHz: 32MHz Â±30ppm Crystal 18pF 40 Ohms HC-49/US; MF: Abracon; MP: ABLS2-32.000MHZ-D4YF-T; SnapEDA_Link: https://www.snapeda.com/parts/ABLS2-32.000MHZ-D4YF-T/Abracon%20LLC/view-part/333468/?ref=snap; Digi-Key_Part_Number: 535-9888-1-ND; Mouser-Purchase-URL: https://snapeda.com/shop?store=Mouser&id=333468; Value: *; Package: HC49/US Abracon; DigiKey-Purchase-URL: https://snapeda.com/shop?store=DigiKey&id=333468; Check_prices: https://www.snapeda.com/parts/ABLS2-32.000MHZ-D4YF-T/Abracon%20LLC/view-part/333468/?ref=eda
R43 = R-0603
R44-R55 = R-EU_R0603: RESISTOR, European symbol; GateName_1: G$1; SymbolName_1: R-EU; DeviceName: R0603; DeviceSetName: R-EU_; LibraryName: rcl
U13 = STM32F103RBT6: ARMÂ® CortexÂ®-M3 STM32F1 Microcontroller IC 32-Bit 72MHz 128KB _128K x 8_ FLASH; MF: STMicroelectronics; Value: *; MP: STM32F103RBT6; Package: LQFP-64 STMicroelectronics; Price: None; SnapEDA_Link: https://www.snapeda.com/parts/STM32F103RBT6/STMicroelectronics/view-part/558286/?ref=snap; Availability: Unavailable

## Sheet Automotive Connector.SchDoc
size A4
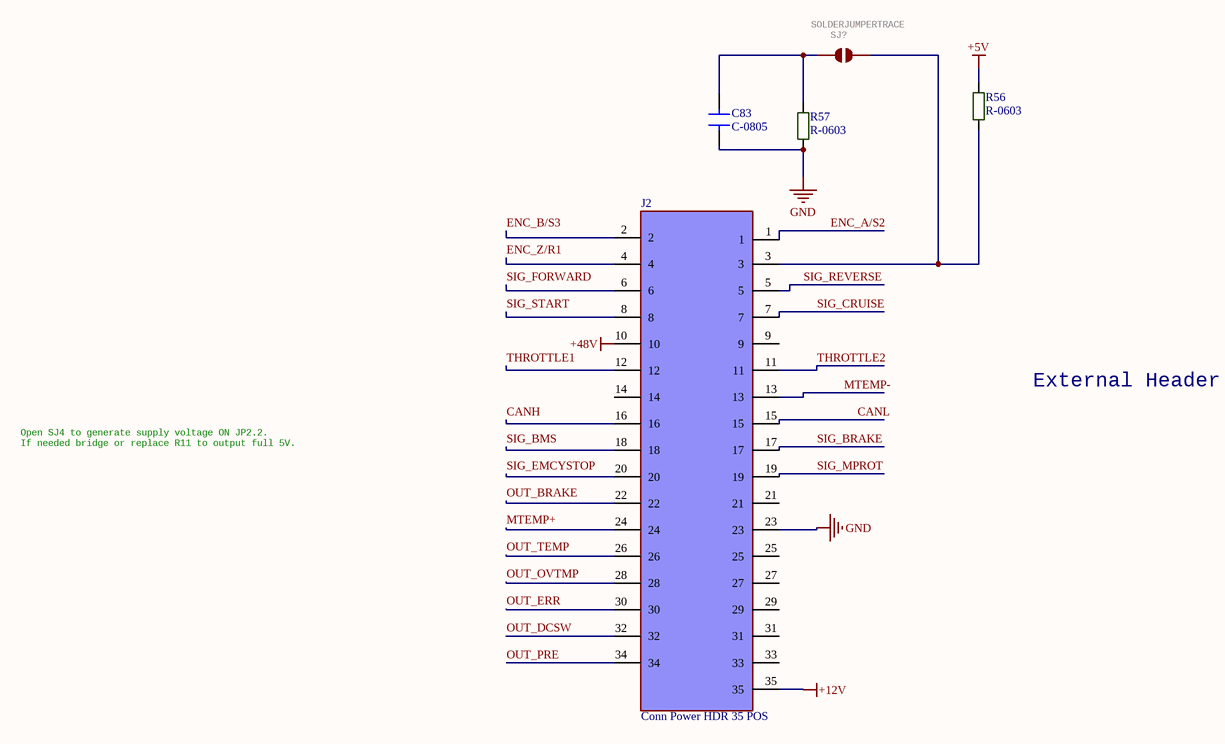
[diagram p6: Automotive Connector.SchDoc]

### Parts
(Parts that share a designator on the sheet are numbered #1, #2 ... from top to bottom, then left to right.)
C83  C-0805  [C-0805]
J2  Conn Power HDR 35 POS  [TE_776230-2]
R56  R-0603  [R-0603R]
R57  R-0603  [R-0603R]
SJ?#1  SOLDERJUMPERTRACE  [SJ_2S-TRACE]

### Nets
+5V: R56.2
+12V: J2.35
+48V: J2.10
GND: C83.1 J2.23 R57.1
CANH: J2.16
CANL: J2.15
ENC_A/S2: J2.1
ENC_B/S3: J2.2
ENC_Z/R1: J2.4
MTEMP+: J2.24
MTEMP-: J2.13
OUT_BRAKE: J2.22
OUT_DCSW: J2.32
OUT_ERR: J2.30
OUT_OVTMP: J2.28
OUT_PRE: J2.34
OUT_TEMP: J2.26
SIG_BMS: J2.18
SIG_BRAKE: J2.17
SIG_CRUISE: J2.7
SIG_EMCYSTOP: J2.20
SIG_FORWARD: J2.6
SIG_MPROT: J2.19
SIG_REVERSE: J2.5
SIG_START: J2.8
THROTTLE1: J2.12
THROTTLE2: J2.11
NetC83_2: C83.2 R57.2 SJ?#1.1
NetJ2_3: J2.3 R56.1 SJ?#1.2

Not connected (* = marked no-connect by the designer): J2 9 14 21 25 27 29 31 33

### Notes on the sheet
- External Header
- Open SJ4 to generate supply voltage ON JP2.2.
  If needed bridge or replace R11 to output full 5V.

### Library data of the parts
J2 = Conn Power HDR 35 POS: Conn Power HDR 35 POS 4mm Solder ST Thru-Hole 35 Terminal 1 Port Automotive Loose; MP: 776230-2; MF: TE Connectivity; Package: None; EU_RoHS_Compliance: Compliant; DigiKey-Purchase-URL: https://snapeda.com/shop?store=DigiKey&id=1466385; Value: *; Availability: Unavailable; Price: None; SnapEDA_Link: https://www.snapeda.com/parts/776230-2/TE%20Connectivity%20AMP%20Connectors/view-part/1466385/?ref=snap
SJ?#1 = SOLDERJUMPERTRACE: Solder JumperStandard SMD solder jumper. Used to automate production. Two varients : Normally Open and Normally Closed are the same, but have different paste layers. NC will have a large amount of paste and should jumper during reflow.; GateName_1: 1; SymbolName_1: SJ; DeviceName: TRACE; LibraryName: SparkFun-Passives; DeviceSetName: SOLDERJUMPER

## Sheet PWM Filter.SchDoc
size A4
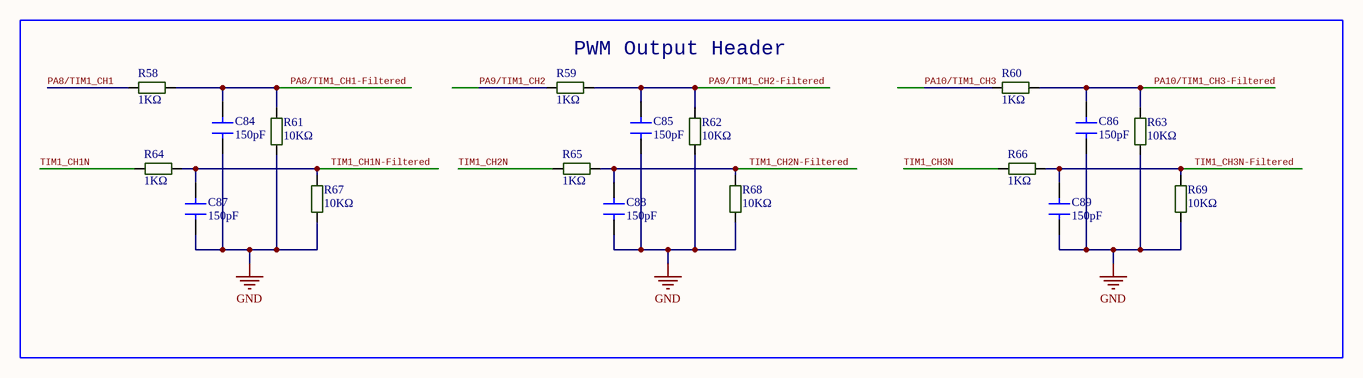
[diagram p7: PWM Filter.SchDoc]

### Parts
C84  150pF  [C-0603W]
C85  150pF  [C-0603W]
C86  150pF  [C-0603W]
C87  150pF  [C-0603W]
C88  150pF  [C-0603W]
C89  150pF  [C-0603W]
R58  1KΩ  [R-0805]
R59  1KΩ  [R-0805]
R60  1KΩ  [R-0805]
R61  10KΩ  [R-0805]
R62  10KΩ  [R-0805]
R63  10KΩ  [R-0805]
R64  1KΩ  [R-0805]
R65  1KΩ  [R-0805]
R66  1KΩ  [R-0805]
R67  10KΩ  [R-0805]
R68  10KΩ  [R-0805]
R69  10KΩ  [R-0805]

### Blocks framed on the sheet
PWM Output Header: C84-C89 R58-R69

### Nets
GND: C84.1 C85.1 C86.1 C87.1 C88.1 C89.1 R61.1 R62.1 R63.1 R67.1 R68.1 R69.1
PA8/TIM1_CH1: R58.1
PA8/TIM1_CH1-Filtered: C84.2 R58.2 R61.2
PA9/TIM1_CH2: R59.1
PA9/TIM1_CH2-Filtered: C85.2 R59.2 R62.2
PA10/TIM1_CH3: R60.1
PA10/TIM1_CH3-Filtered: C86.2 R60.2 R63.2
TIM1_CH1N: R64.1
TIM1_CH1N-Filtered: C87.2 R64.2 R67.2
TIM1_CH2N: R65.1
TIM1_CH2N-Filtered: C88.2 R65.2 R68.2
TIM1_CH3N: R66.1
TIM1_CH3N-Filtered: C89.2 R66.2 R69.2

### Library data of the parts
C84-C89 = C-0603
R58-R69 = R-0805

## Sheet Voltage Regulation.SchDoc
size A4
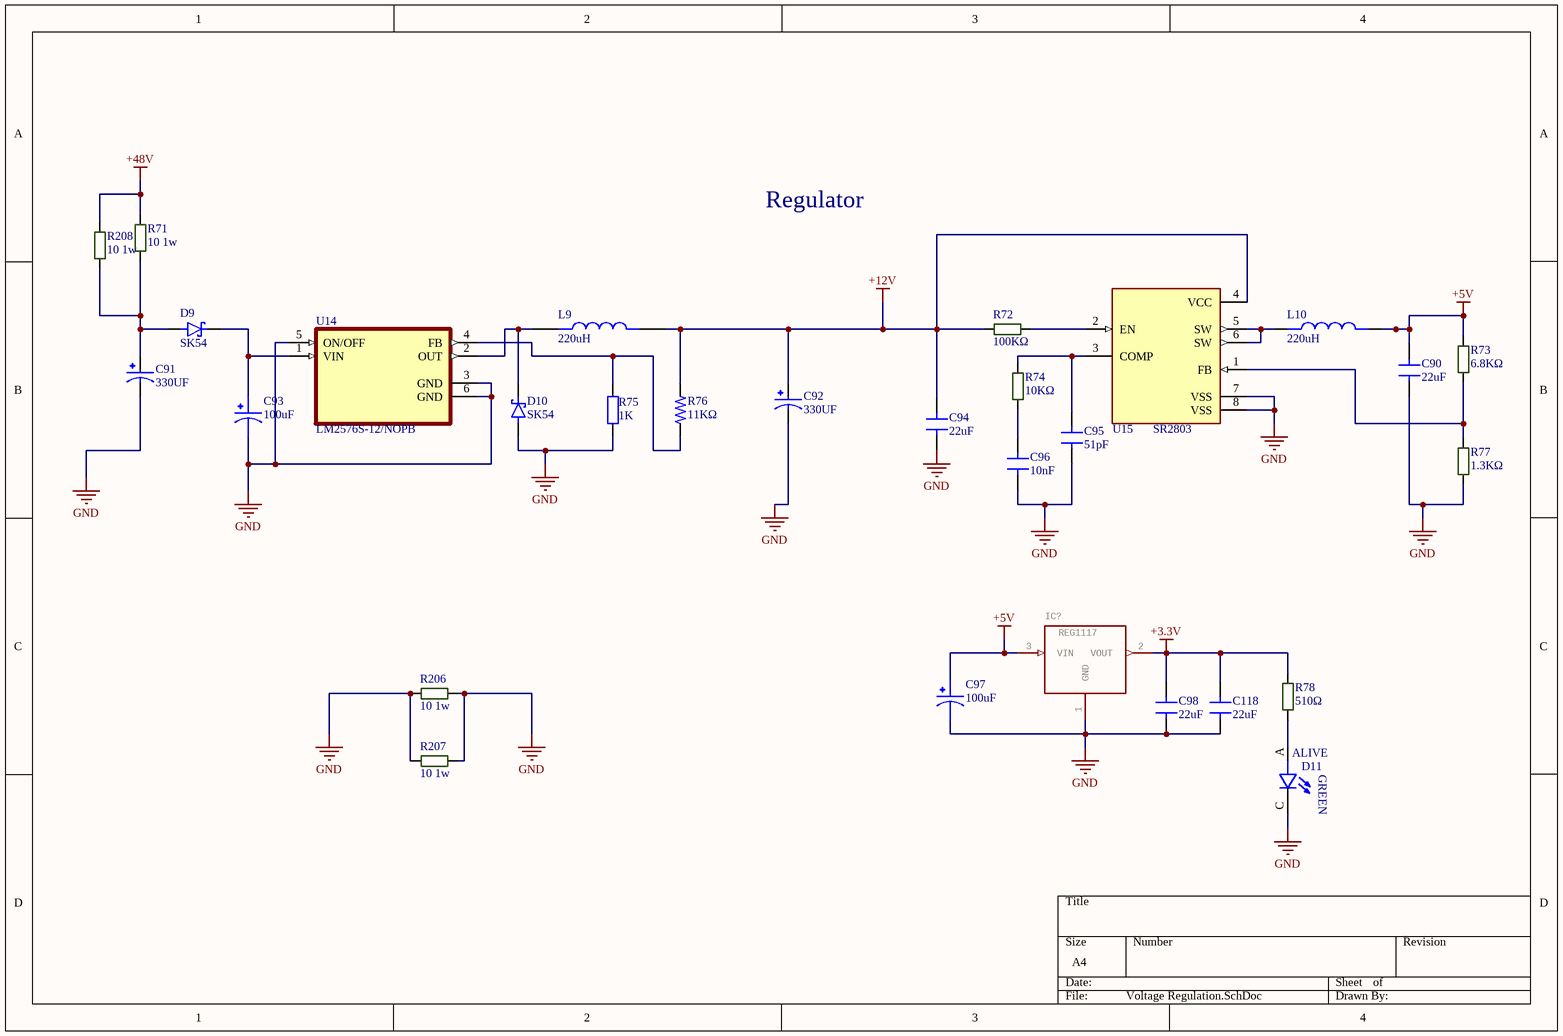
[diagram p8: Voltage Regulation.SchDoc]

### Parts
(Parts that share a designator on the sheet are numbered #1, #2 ... from top to bottom, then left to right.)
C90  22uF  [C-0805]
C91  330UF  [CAP_EEETC1C331V]
C92  330UF  [CAP_EEETC1C331V]
C93  100uF  [CapSmdElc]
C94  22uF  [C-0805]
C95  51pF  [C-0603W]
C96  10nF  [C-0805]
C97  100uF  [CapSmdElc]
C98  22uF  [C-0805]
C118  22uF  [C-0805]
D9  SK54  [DIOM7959X265N]
D10  SK54  [DIOM7959X265N]
D11  ALIVE  [LED_7012X1]
IC?#2  REG1117  [SOT223]
L9  220uH  [IND_MDH12577C-101MA=P3]
L10  220uH  [IND_MDH12577C-101MA=P3]
R71  10 1w  [R-2512]
R72  100KΩ  [R-0805]
R73  6.8KΩ  [R-0603R]
R74  10KΩ  [R-0805]
R75  Deger: 1K  [R-0805]  (hidden comment: RES SMD 1K OHM 1% 1/8W 0805)
R76  11KΩ  [R-0805]
R77  1.3KΩ  [R-0603R]
R78  510Ω  [R-0603R]
R206  10 1w  [R-2512]
R207  10 1w  [R-2512]
R208  10 1w  [R-2512]
U14  LM2576S-12/NOPB  [VREG_TPS79625KTTR]
U15  SR2803  [SOP127P600X175-8N]

### Nets
+3.3V: C98.2 C118.2 IC?#2.2(VOUT) R78.2
+5V: C90.2 C97.1 IC?#2.3(VIN) L10.2 R73.2
+12V: C92.1 C94.2 L9.2 R72.2 R76.2 U15.4(VCC)
+48V: R71.2 R208.2
GND: C90.1 C91.2 C92.2 C93.2 C94.1 C95.1 C96.1 C97.2 C98.1 C118.1 D10.A D11.C IC?#2.1(GND) R75.1 R77.1 R206.1 R206.2 R207.1 R207.2 U14.3(GND) U14.5(ON/OFF) U14.6(GND) U15.7(VSS) U15.8(VSS)
NetC91_1: C91.1 D9.A R71.1 R208.1
NetC93_1: C93.1 D9.C(K) U14.1(VIN)
NetC95_2: C95.2 R74.2 U15.3(COMP)
NetC96_2: C96.2 R74.1
NetD10_C: D10.C(K) L9.1 U14.2(OUT)
NetD11_A: D11.A R78.1
NetL10_1: L10.1 U15.5(SW) U15.6(SW)
NetR72_1: R72.1 U15.2(EN)
NetR73_1: R73.1 R77.2 U15.1(FB)
NetR75_2: R75.2 R76.1 U14.4(FB)

### Notes on the sheet
- Regulator
- (in symbol ALIVE) GREEN

### Library data of the parts
C90 C94 C96 C98 C118 = C-0805
C91 C92 = CAP 330UF SMD: CAP ALUM 330UF 20% 16V SMD; MP: EEE-TC1C331V; MF: Panasonic Electronic Components; Value: *; Package: RADIAL-2 Panasonic; Availability: In Stock; SnapEDA_Link: https://www.snapeda.com/parts/EEE-TC1C331V/Panasonic/view-part/6178283/?ref=snap; Price: None; Purchase-URL: https://pricing.snapeda.com/search/part/EEE-TC1C331V/?ref=eda; Check_prices: https://www.snapeda.com/parts/EEE-TC1C331V/Panasonic/view-part/6178283/?ref=eda
C93 C97 = 100 uF Electr Cap
C95 = C-0603
D9 D10 = SK54: Diode Schottky 40V 5A Surface Mount DO-214AA (SMB); MP: MBRS320T3G; MF: ON Semiconductor; Package: DO-214 ON Semiconductor; Availability: Good; Arrow_Electronics-Purchase-URL: https://snapeda.com/shop?store=Arrow+Electronics&id=432205; SnapEDA_Link: https://www.snapeda.com/parts/MBRS320T3G/ON%20Semiconductor/view-part/432205/?ref=snap; DigiKey-Purchase-URL: https://snapeda.com/shop?store=DigiKey&id=432205; Mouser-Purchase-URL: https://snapeda.com/shop?store=Mouser&id=432205; Value: *; Price: None
D11 = ALIVE: as D7 on sheet Main MCU; Package: None; Price: None; Value: *; Availability: Unavailable
IC?#2 = REG1117: 800mA and 1A Low Dropout (LDO) Positive Regulator   1.8V, 2.5V, 2.85V, 3.3V, 5V, and Adj; GateName_1: G$1; SymbolName_1: REG1118; LibraryName: burr-brown; DeviceSetName: REG1117; MF: MF; MPN: REG1117; OC_FARNELL: 1097566; OC_NEWARK: 14P6981
L9 L10 = 220uH Inductor SMD: Inductor Power Shielded Wirewound 220uH 20% 100KHz Ferrite 1.1A 0.325Ohm DCR 5049 Automotive T/R; MP: MDH12577C-101MA=P3; Package: None; Price: None; Value: *; Availability: Unavailable
R71 R206-R208 = R-2512
R72 R74 = R-0805
R73 R77 R78 = R-0603
R75 = 1K 0805: 1 kOhms ±1% 0.125W, 1/8W Chip Resistor 0805 (2012 Metric) Moisture Resistant Thick Film; Cins: Direnc; Uretici Kodu: RC0805FR-071KL; Kılıf: 0805; -Sicaklik: -55; +Sicaklik: +155; Lehim Yöntemi: SMD; MSL: 1 (Unlimited)
R76 = RES 11KΩ SMD: THICK FILM RESISTOR, 11KOHM, 125mW, 5%; MP: CRCW080511K0JNEA; Package: None; Price: None; Value: *; Availability: Unavailable
U14 = LM2576S-12/NOPB: SIMPLE SWITCHER&reg; 40V, 3A Low Component Count Step-Down Regulator 5-DDPAK/TO-263 -40 to 125; MF: Texas Instruments; Availability: Warning; SnapEDA_Link: https://www.snapeda.com/parts/LM2576S-12/NOPB/Texas%20Instruments/view-part/470772/?ref=snap; Mouser-Purchase-URL: https://snapeda.com/shop?store=Mouser&id=470772; Texas_Instruments-Purchase-URL: https://snapeda.com/shop?store=Texas+Instruments&id=470772; Value: *; Price: None; Package: TO-263-5 Texas Instruments; DigiKey-Purchase-URL: https://snapeda.com/shop?store=DigiKey&id=470772; MP: LM2576S-12/NOPB; BuyPart: https://www.snapeda.com/parts/LM2576S-12/NOPB/Texas%20Instruments/view-part/470772/?ref=eda
U15 = SR2803: 330KHZ, 3A SYNCHRONOUS / BUCK CONTROLLER; MF: Taiwan Semiconductor Corporation; MP: TS2509CS RLG; Package: SOP-8 Taiwan Semiconductor; Check_prices: https://www.snapeda.com/parts/TS2509CS%20RLG/Taiwan+Semiconductor+Corporation/view-part/?ref=eda; Value: *; Price: None; Availability: In Stock; SnapEDA_Link: https://www.snapeda.com/parts/TS2509CS%20RLG/Taiwan+Semiconductor+Corporation/view-part/?ref=snap

## Sheet Output Driver.SchDoc
size A4
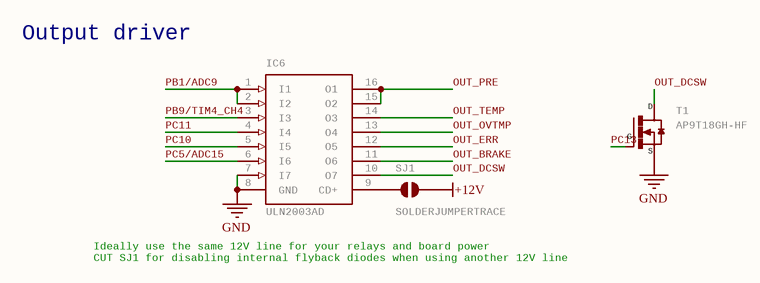
[diagram p9: Output Driver.SchDoc]

### Parts
IC6  ULN2003AD  [SO16]
SJ1  SOLDERJUMPERTRACE  [SJ_2S-TRACE]
T1  AP9T18GH-HF  [D-PAK_TO252AA]

### Nets
+12V: SJ1.2
GND: IC6.7(I7) IC6.8(GND) T1.3(S)
OUT_BRAKE: IC6.11(O6)
OUT_DCSW: IC6.10(O7) T1.4(D)
OUT_ERR: IC6.12(O5)
OUT_OVTMP: IC6.13(O4)
OUT_PRE: IC6.15(O2) IC6.16(O1)
OUT_TEMP: IC6.14(O3)
PB1/ADC9: IC6.1(I1) IC6.2(I2)
PB9/TIM4_CH4: IC6.3(I3)
PC5/ADC15: IC6.6(I6)
PC10: IC6.5(I5)
PC11: IC6.4(I4)
PC13: T1.1(G)
NetIC6_9: IC6.9(CD+) SJ1.1

### Notes on the sheet
- Output driver
- Ideally use the same 12V line for your relays and board power
  CUT SJ1 for disabling internal flyback diodes when using another 12V line

### Library data of the parts
IC6 = ULN2003AD: DRIVER ARRAY; GateName_1: A; SymbolName_1: 2001A; DeviceName: D; LibraryName: uln-udn; DeviceSetName: ULN2003A
SJ1 = SOLDERJUMPERTRACE: as SJ?#1 on sheet Automotive Connector; LibraryName: SparkFun-Passives; DeviceSetName: SOLDERJUMPER
T1 = AP9T18GH-HF: GateName_1: G$1; SymbolName_1: MOSFET_N; LibraryName: transistor-power; DeviceSetName: AP9T18GH-HF; D: D; S: S; G: G

## Sheet Communication.SchDoc
size A4
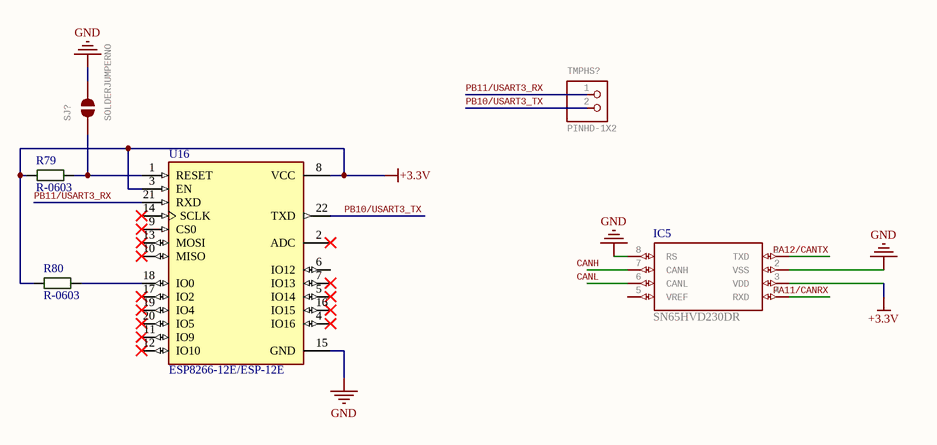
[diagram p10: Communication.SchDoc]

### Parts
(Parts that share a designator on the sheet are numbered #1, #2 ... from top to bottom, then left to right.)
IC5  SN65HVD230DR  [SO08]
R79  R-0603  [R-0603R]
R80  R-0603  [R-0603R]
SJ?#2  SOLDERJUMPERNO  [SJ_2S-NO]
TMPHS?#1  PINHD-1X2  [1X02]
U16  ESP8266-12E/ESP-12E  [XCVR_ESP8266-12E/ESP-12E]

### Nets
+3.3V: IC5.3(VDD) R79.1 R80.1 U16.3(EN) U16.8(VCC)
GND: IC5.2(VSS) IC5.8(RS) SJ?#2.2 U16.15(GND)
CANH: IC5.7(CANH)
CANL: IC5.6(CANL)
PA11/CANRX: IC5.4(RXD)
PA12/CANTX: IC5.1(TXD)
PB10/USART3_TX: TMPHS?#1.2 U16.22(TXD)
PB11/USART3_RX: TMPHS?#1.1 U16.21(RXD)
NetR79_2: R79.2 SJ?#2.1 U16.1(RESET)
NetR80_2: R80.2 U16.18(IO0)

Not connected (* = marked no-connect by the designer): IC5 5(VREF); U16 2(ADC)* 4(IO16)* 5(IO14)* 6(IO12) 7(IO13)* 9(CS0)* 10(MISO)* 11(IO9)* 12(IO10)* 13(MOSI)* 14(SCLK)* 16(IO15)* 17(IO2)* 19(IO4)* 20(IO5)*

### Library data of the parts
IC5 = MCP2551: CAN transceiver; GateName_1: G$1; SymbolName_1: MCP2551; LibraryName: SparkFun-DigitalIC; DeviceSetName: MCP2551
SJ?#2 = SOLDERJUMPERNO: Solder JumperStandard SMD solder jumper. Used to automate production. Two varients : Normally Open and Normally Closed are the same, but have different paste layers. NC will have a large amount of paste and should jumper during reflow.; GateName_1: 1; SymbolName_1: SJ; DeviceName: NO; LibraryName: SparkFun-Passives; DeviceSetName: SOLDERJUMPER
TMPHS?#1 = PINHD-1X2: PIN HEADER; GateName_1: G$1; SymbolName_1: PINHD2; LibraryName: pinhead; DeviceSetName: PINHD-1X2
U16 = ESP8266-12E/ESP-12E: This WiFi module has a 32-bit MCU micro and clock speeds supporting 80 MHz or 160 MHz. Supports the RTOS and integrated Wi-Fi MAC/BB/RF/PA/LNA, and has an on-board antenna.; MF: AI-Thinker; Price: None; Package: None; Value: *; MP: ESP8266-12E/ESP-12E; Availability: Unavailable; SnapEDA_Link: https://www.snapeda.com/parts/ESP8266-12E/ESP-12E/AI-Thinker/view-part/106414/?ref=snap

## Sheet Current Voltage Sensors.SchDoc
size A4
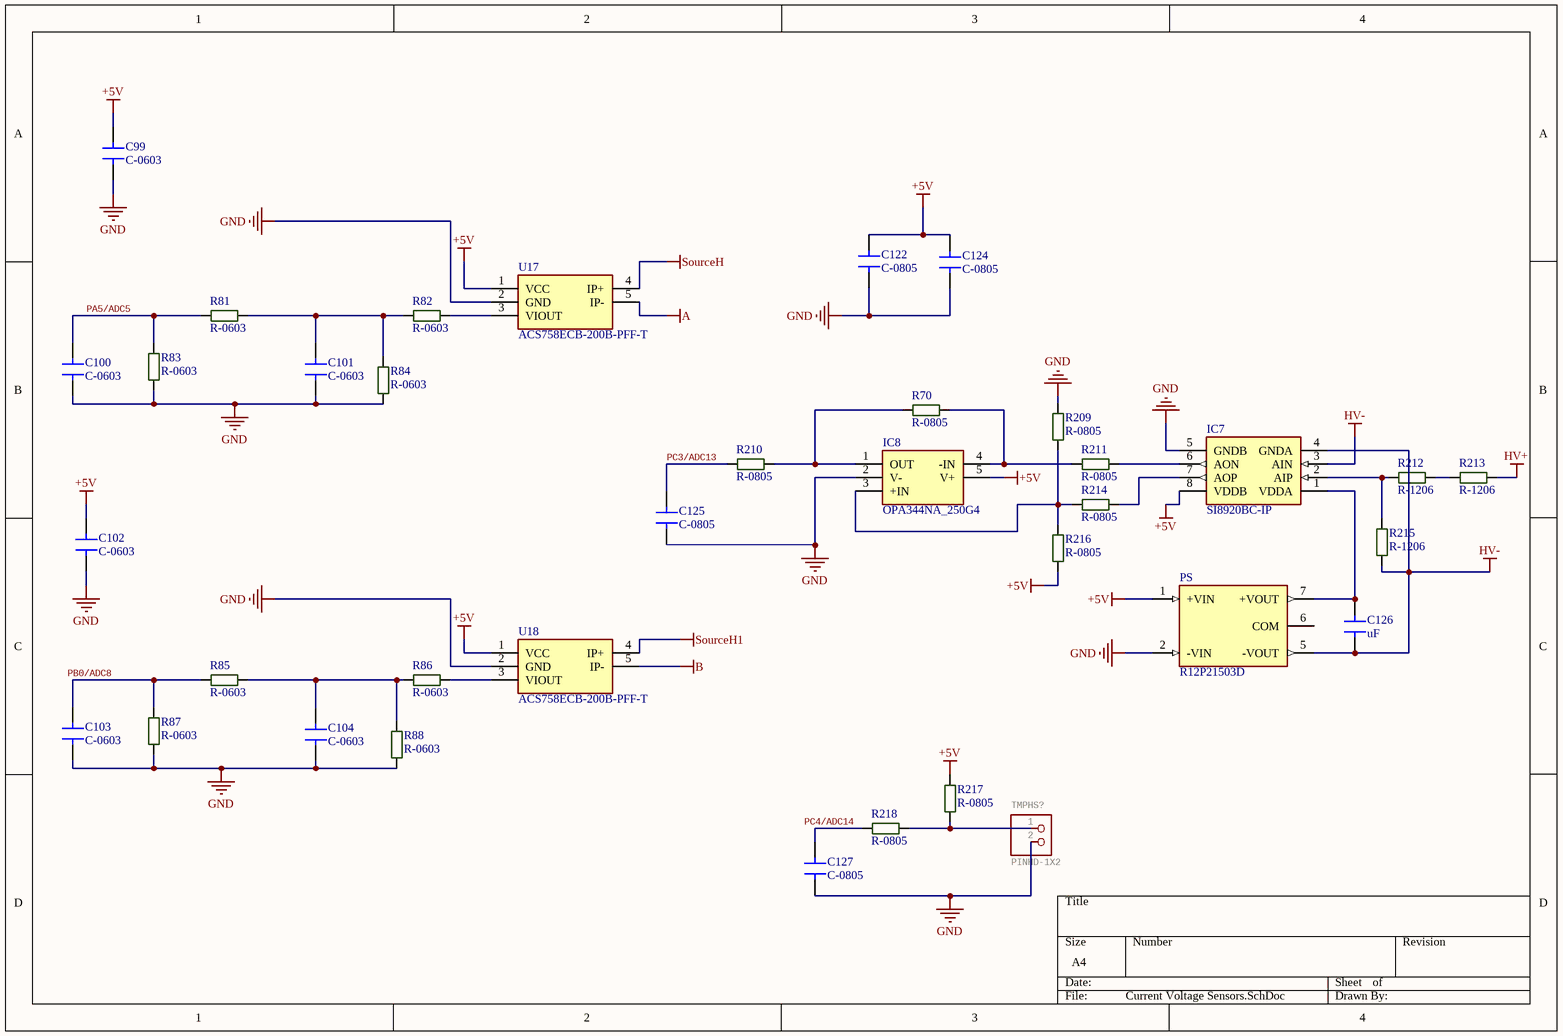
[diagram p11: Current Voltage Sensors.SchDoc]

### Parts
(Parts that share a designator on the sheet are numbered #1, #2 ... from top to bottom, then left to right.)
C99  C-0603  [C-0603W]
C100  C-0603  [C-0603W]
C101  C-0603  [C-0603W]
C102  C-0603  [C-0603W]
C103  C-0603  [C-0603W]
C104  C-0603  [C-0603W]
C122  C-0805  [C-0805]
C124  C-0805  [C-0805]
C125  C-0805  [C-0805]
C126  uF  [C-1206]
C127  C-0805  [C-0805]
IC7  SI8920BC-IP  [SOP254P965X419-8N]
IC8  OPA344NA_250G4  [SOT95P280X145-5N]
PS  R12P21503D  [CONV_R12P21503D]
R70  R-0805  [R-0805]
R81  R-0603  [R-0603R]
R82  R-0603  [R-0603R]
R83  R-0603  [R-0603R]
R84  R-0603  [R-0603R]
R85  R-0603  [R-0603R]
R86  R-0603  [R-0603R]
R87  R-0603  [R-0603R]
R88  R-0603  [R-0603R]
R209  R-0805  [R-0805]
R210  R-0805  [R-0805]
R211  R-0805  [R-0805]
R212  R-1206  [R-1206]
R213  R-1206  [R-1206]
R214  R-0805  [R-0805]
R215  R-1206  [R-1206]
R216  R-0805  [R-0805]
R217  R-0805  [R-0805]
R218  R-0805  [R-0805]
TMPHS?#2  PINHD-1X2  [1X02]
U17  ACS758ECB-200B-PFF-T  [ACS756SCA-050B-PFF-T_2]
U18  ACS758ECB-200B-PFF-T  [ACS756SCA-050B-PFF-T_2]

### Nets
+5V: C99.2 C102.2 C122.2 C124.2 IC7.8(VDDB) IC8.5(V+) PS.1(+VIN) R216.1 R217.1 U17.1(VCC) U18.1(VCC)
A: U17.5(IP-)
B: U18.5(IP-)
GND: C99.1 C100.1 C101.1 C102.1 C103.1 C104.1 C122.1 C124.1 C125.1 C127.1 IC7.5(GNDB) IC8.2(V-) PS.2(-VIN) R83.1 R84.1 R87.1 R88.1 R209.2 TMPHS?#2.2 U17.2(GND) U18.2(GND)
HV+: R213.2
HV-: C126.1 IC7.3(AIN) IC7.4(GNDA) PS.5(-VOUT) R215.1
SourceH: U17.4(IP+)
SourceH1: U18.4(IP+)
PA5/ADC5: C100.2 R81.1 R83.2
PB0/ADC8: C103.2 R85.1 R87.2
PC3/ADC13: C125.2 R210.2
PC4/ADC14: C127.2 R218.2
NetC101_2: C101.2 R81.2 R82.1 R84.2
NetC104_2: C104.2 R85.2 R86.1 R88.2
NetC126_2: C126.2 IC7.1(VDDA) PS.7(+VOUT)
NetIC7_2: IC7.2(AIP) R212.1 R215.2
NetIC7_6: IC7.6(AON) R211.2
NetIC7_7: IC7.7(AOP) R214.2
NetIC8_1: IC8.1(OUT) R70.2 R210.1
NetIC8_3: IC8.3(+IN) R209.1 R214.1 R216.2
NetIC8_4: IC8.4(-IN) R70.1 R211.1
NetR82_2: R82.2 U17.3(VIOUT)
NetR86_2: R86.2 U18.3(VIOUT)
NetR212_2: R212.2 R213.1
NetR217_2: R217.2 R218.1 TMPHS?#2.1

Not connected (* = marked no-connect by the designer): PS 6(COM)

### Library data of the parts
C126 = C-1206
IC7 = SI8920BC-IP: Integrated Circuit; Manufacturer_Name: Silicon Labs; Datasheet Link: https://mouser.componentsearchengine.com/Datasheets/2/SI8920BC-IP.pdf; Height: 4.19mm; Manufacturer_Part_Number: SI8920BC-IP; Mouser Part Number: 634-SI8920BC-IP; Mouser Price/Stock: https://www.mouser.co.uk/ProductDetail/Silicon-Labs/SI8920BC-IP?qs=bB7QTEcmLuN2VIVidYwh9w%3D%3D; Arrow Part Number: SI8920BC-IP; Arrow Price/Stock: https://www.arrow.com/en/products/si8920bc-ip/silicon-labs?region=nac
IC8 = OPA344NA_250G4: Integrated Circuit; Manufacturer_Name: Texas Instruments; Manufacturer_Part_Number: OPA344NA/250G4; Datasheet Link: http://www.ti.com/lit/ds/symlink/opa344.pdf; Height: 1.45mm; Mouser Part Number: 595-OPA344NA/250G4; Mouser Price/Stock: https://www.mouser.co.uk/ProductDetail/Texas-Instruments/OPA344NA-250G4?qs=7nS3%252BbEUL6s62po7Pq3eXQ%3D%3D; Arrow Part Number: OPA344NA/250G4; Arrow Price/Stock: https://www.arrow.com/en/products/opa344na250g4/texas-instruments?region=nac
PS = R12P21503D: 2W DC/DC-Converter 'ECONOLINE' SIP7 6.4kV unreg; MF: Recom Power; SnapEDA_Link: https://www.snapeda.com/parts/R12P21503D/Recom%20Power/view-part/1592429/?ref=snap; Value: *; Digi-Key_Purchase_URL: https://www.digikey.ca/product-detail/en/recom-power/R12P21503D/945-3069-5-ND/7354331?utm_source=snapeda&utm_medium=aggregator&utm_campaign=symbol; Digi-Key_Part_Number: 945-3069-5-ND; MP: R12P21503D; Package: SIP-7 Recom Power
R212 R213 R215 = R-1206: Res1206
TMPHS?#2 = PINHD-1X2: as TMPHS?#1 on sheet Communication; LibraryName: pinhead; DeviceSetName: PINHD-1X2
U17 U18 = ACS758ECB-200B-PFF-T: Undefined or Miscellaneous; Manufacturer_Name: Allegro Microsystems; Datasheet Link: http://www.farnell.com/datasheets/926109.pdf; Manufacturer_Part_Number: ACS758ECB-200B-PFF-T; Arrow Part Number: ACS758ECB-200B-PFF-T; Arrow Price/Stock: https://www.arrow.com/en/products/acs758ecb-200b-pff-t/allegro-microsystems

## Sheet Input Filtering.SchDoc
size A4
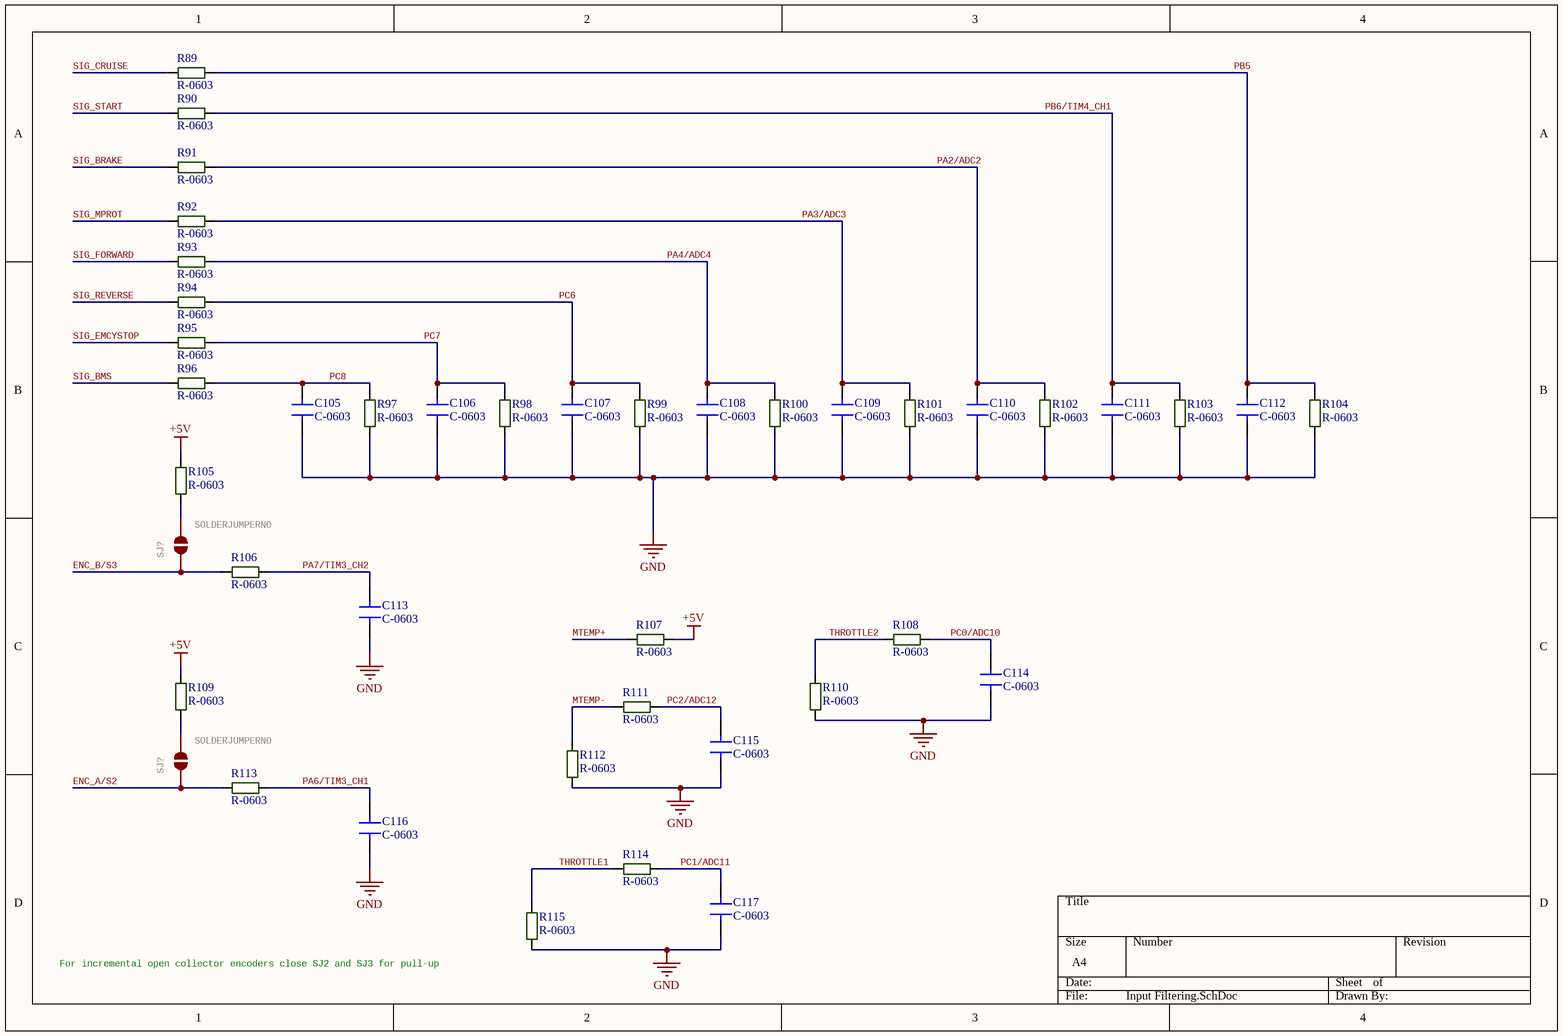
[diagram p12: Input Filtering.SchDoc]

### Parts
(Parts that share a designator on the sheet are numbered #1, #2 ... from top to bottom, then left to right.)
C105  C-0603  [C-0603W]
C106  C-0603  [C-0603W]
C107  C-0603  [C-0603W]
C108  C-0603  [C-0603W]
C109  C-0603  [C-0603W]
C110  C-0603  [C-0603W]
C111  C-0603  [C-0603W]
C112  C-0603  [C-0603W]
C113  C-0603  [C-0603W]
C114  C-0603  [C-0603W]
C115  C-0603  [C-0603W]
C116  C-0603  [C-0603W]
C117  C-0603  [C-0603W]
R89  R-0603  [R-0603R]
R90  R-0603  [R-0603R]
R91  R-0603  [R-0603R]
R92  R-0603  [R-0603R]
R93  R-0603  [R-0603R]
R94  R-0603  [R-0603R]
R95  R-0603  [R-0603R]
R96  R-0603  [R-0603R]
R97  R-0603  [R-0603R]
R98  R-0603  [R-0603R]
R99  R-0603  [R-0603R]
R100  R-0603  [R-0603R]
R101  R-0603  [R-0603R]
R102  R-0603  [R-0603R]
R103  R-0603  [R-0603R]
R104  R-0603  [R-0603R]
R105  R-0603  [R-0603R]
R106  R-0603  [R-0603R]
R107  R-0603  [R-0603R]
R108  R-0603  [R-0603R]
R109  R-0603  [R-0603R]
R110  R-0603  [R-0603R]
R111  R-0603  [R-0603R]
R112  R-0603  [R-0603R]
R113  R-0603  [R-0603R]
R114  R-0603  [R-0603R]
R115  R-0603  [R-0603R]
SJ?#3  SOLDERJUMPERNO  [SJ_2S-NO]
SJ?#4  SOLDERJUMPERNO  [SJ_2S-NO]

### Nets
+5V: R105.2 R107.2 R109.2
GND: C105.1 C106.1 C107.1 C108.1 C109.1 C110.1 C111.1 C112.1 C113.1 C114.1 C115.1 C116.1 C117.1 R97.1 R98.1 R99.1 R100.1 R101.1 R102.1 R103.1 R104.1 R110.1 R112.1 R115.1
ENC_A/S2: R113.1 SJ?#4.1
ENC_B/S3: R106.1 SJ?#3.1
MTEMP+: R107.1
MTEMP-: R111.1 R112.2
PA2/ADC2: C110.2 R91.2 R102.2
PA3/ADC3: C109.2 R92.2 R101.2
PA4/ADC4: C108.2 R93.2 R100.2
PA6/TIM3_CH1: C116.2 R113.2
PA7/TIM3_CH2: C113.2 R106.2
PB5: C112.2 R89.2 R104.2
PB6/TIM4_CH1: C111.2 R90.2 R103.2
PC0/ADC10: C114.2 R108.2
PC1/ADC11: C117.2 R114.2
PC2/ADC12: C115.2 R111.2
PC6: C107.2 R94.2 R99.2
PC7: C106.2 R95.2 R98.2
PC8: C105.2 R96.2 R97.2
SIG_BMS: R96.1
SIG_BRAKE: R91.1
SIG_CRUISE: R89.1
SIG_EMCYSTOP: R95.1
SIG_FORWARD: R93.1
SIG_MPROT: R92.1
SIG_REVERSE: R94.1
SIG_START: R90.1
THROTTLE1: R114.1 R115.2
THROTTLE2: R108.1 R110.2
NetR105_1: R105.1 SJ?#3.2
NetR109_1: R109.1 SJ?#4.2

### Notes on the sheet
- For incremental open collector encoders close SJ2 and SJ3 for pull-up

### Library data of the parts
SJ?#3 SJ?#4 = SOLDERJUMPERNO: as SJ?#2 on sheet Communication; LibraryName: SparkFun-Passives; DeviceSetName: SOLDERJUMPER